# EasyEDA schematic EasyEDA_Esquematico.json
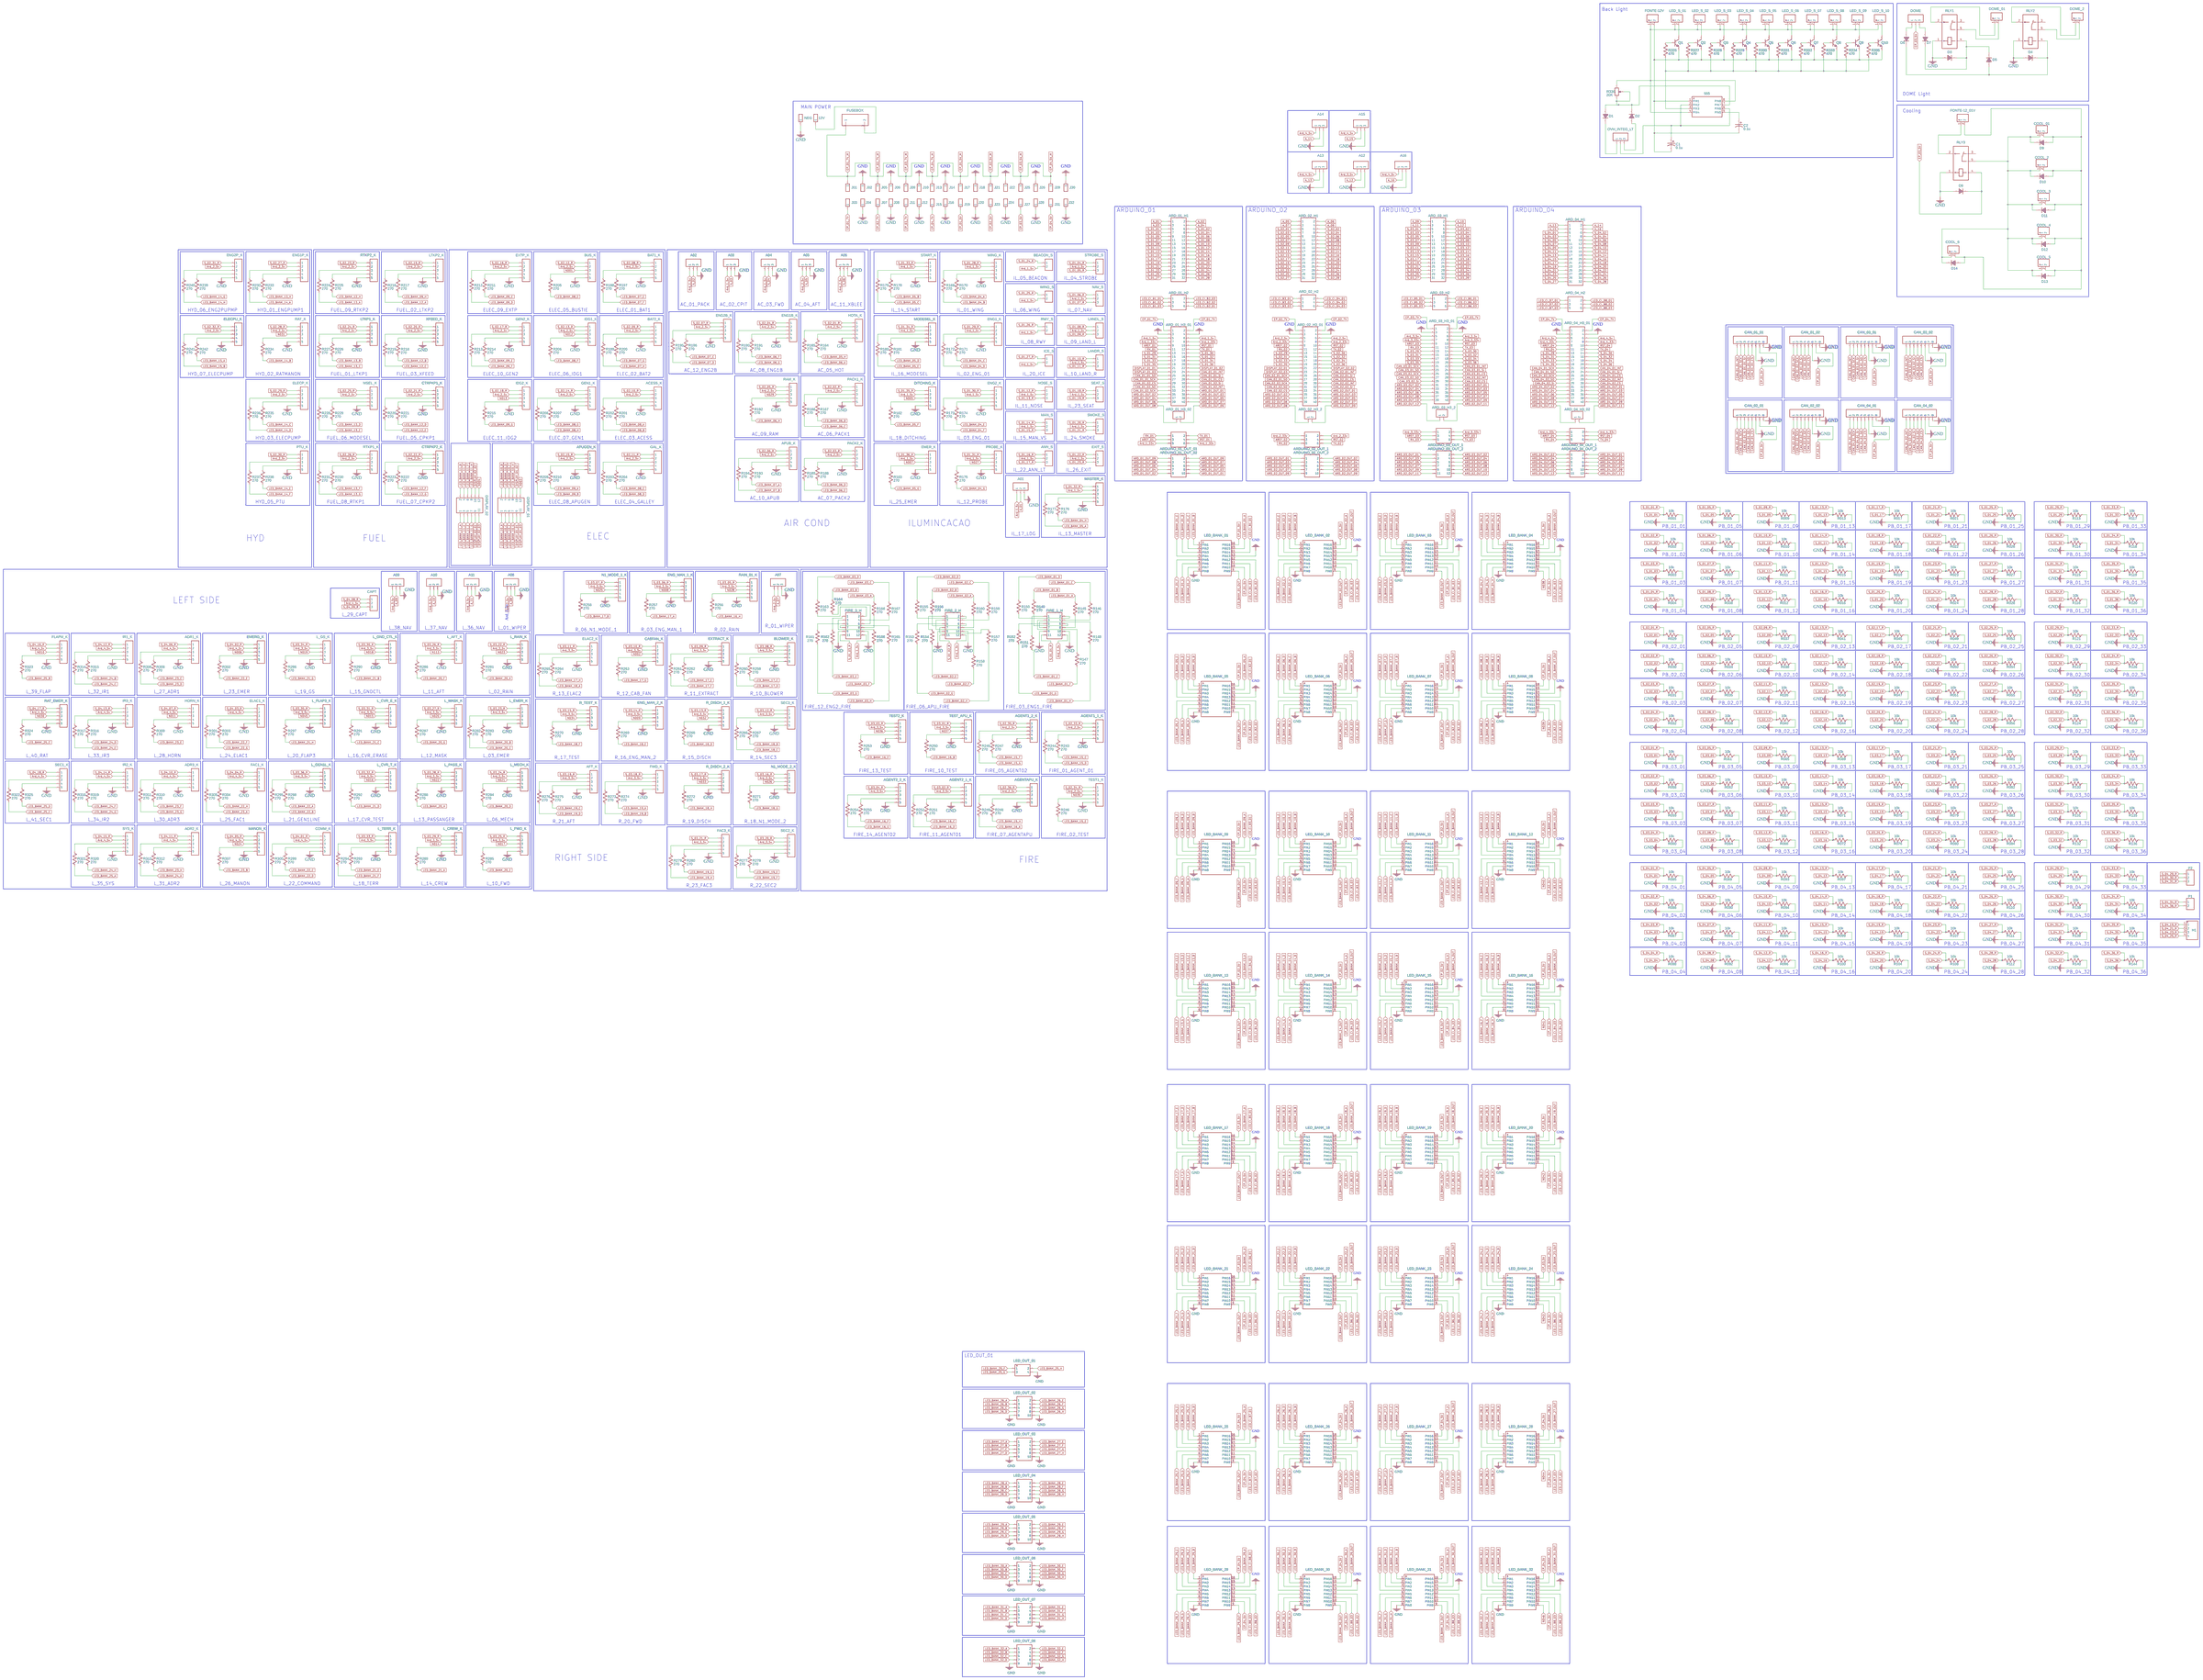
[diagram p0: schematic sheet]

## Parts
12V  HDR-M-2.54_1x1  [HDR-M-2.54_1X1]
555  DS1001-01-08BT1NSF6X-JKB  [DIP-8_L10.0-W6.5-P2.54-LS7.6-BL]
A01  Header-Male-2.54_1x3  [HDR-TH_3P-P2.54-V]
A02  Header-Male-2.54_1x3  [HDR-TH_3P-P2.54-V]
A03  Header-Male-2.54_1x3  [HDR-TH_3P-P2.54-V]
A04  Header-Male-2.54_1x3  [HDR-TH_3P-P2.54-V]
A05  Header-Male-2.54_1x3  [HDR-TH_3P-P2.54-V]
A06  Header-Male-2.54_1x3  [HDR-TH_3P-P2.54-V]
A07  Header-Male-2.54_1x3  [HDR-TH_3P-P2.54-V]
A08  Header-Male-2.54_1x3  [HDR-TH_3P-P2.54-V]
A09  Header-Male-2.54_1x3  [HDR-TH_3P-P2.54-V]
A10  Header-Male-2.54_1x3  [HDR-TH_3P-P2.54-V]
A11  Header-Male-2.54_1x3  [HDR-TH_3P-P2.54-V]
A12  Header-Male-2.54_1x3  [HDR-TH_3P-P2.54-V]
A13  Header-Male-2.54_1x3  [HDR-TH_3P-P2.54-V]
A14  Header-Male-2.54_1x3  [HDR-TH_3P-P2.54-V]
A15  Header-Male-2.54_1x3  [HDR-TH_3P-P2.54-V]
A16  Header-Male-2.54_1x3  [HDR-TH_3P-P2.54-V]
ACESS_K  Header-Female-2.54_1x5  [HDR-TH_5P-P2.54-V]
ADR1_K  Header-Female-2.54_1x5  [HDR-TH_5P-P2.54-V]
ADR2_K  Header-Female-2.54_1x5  [HDR-TH_5P-P2.54-V]
ADR3_K  Header-Female-2.54_1x5  [HDR-TH_5P-P2.54-V]
AFT_K  Header-Female-2.54_1x5  [HDR-TH_5P-P2.54-V]
AGENT1_1_K  Header-Female-2.54_1x5  [HDR-TH_5P-P2.54-V]
AGENT1_2_K  Header-Female-2.54_1x5  [HDR-TH_5P-P2.54-V]
AGENT2_1_K  Header-Female-2.54_1x5  [HDR-TH_5P-P2.54-V]
AGENT2_2_K  Header-Female-2.54_1x5  [HDR-TH_5P-P2.54-V]
AGENTAPU_K  Header-Female-2.54_1x5  [HDR-TH_5P-P2.54-V]
ANN_S  Header-Female-2.54_1x3  [HDR-TH_3P-P2.54-V]
APUB_K  Header-Female-2.54_1x5  [HDR-TH_5P-P2.54-V]
APUGEN_K  Header-Female-2.54_1x5  [HDR-TH_5P-P2.54-V]
ARD_01_H1  Header-Female-2.54_2x16  [HDR-TH_32P-P2.54-V-M-R2-C16-S2.54]
ARD_01_H2  Header-Female-2.54_2x3  [HDR-TH_6P-P2.54-V-R2-C3-S2.54]
ARD_01_H3_01  Header-Female-2.54_2x20  [HDR-TH_40P-P2.54-V-R2-C20-S2.54]
ARD_01_H3_02  Header-Female-2.54_1x2  [HDR-TH_2P-P2.54-V-M]
ARD_02_H1  Header-Female-2.54_2x16  [HDR-TH_32P-P2.54-V-M-R2-C16-S2.54]
ARD_02_H2  Header-Female-2.54_2x3  [HDR-TH_6P-P2.54-V-R2-C3-S2.54]
ARD_02_H3_01  Header-Female-2.54_2x20  [HDR-TH_40P-P2.54-V-R2-C20-S2.54]
ARD_02_H3_2  Header-Female-2.54_1x2  [HDR-TH_2P-P2.54-V-M]
ARD_03_H1  Header-Female-2.54_2x16  [HDR-TH_32P-P2.54-V-M-R2-C16-S2.54]
ARD_03_H2  Header-Female-2.54_2x3  [HDR-TH_6P-P2.54-V-R2-C3-S2.54]
ARD_03_H3_01  Header-Female-2.54_2x20  [HDR-TH_40P-P2.54-V-R2-C20-S2.54]
ARD_03_H3_2  Header-Female-2.54_1x2  [HDR-TH_2P-P2.54-V-M]
ARD_04_H1  Header-Female-2.54_2x16  [HDR-TH_32P-P2.54-V-M-R2-C16-S2.54]
ARD_04_H2  Header-Female-2.54_2x3  [HDR-TH_6P-P2.54-V-R2-C3-S2.54]
ARD_04_H3_01  Header-Female-2.54_2x20  [HDR-TH_40P-P2.54-V-R2-C20-S2.54]
ARD_04_H3_02  Header-Female-2.54_1x2  [HDR-TH_2P-P2.54-V-M]
ARDIUNO_04_OUT_2  Header-Female-2.54_2x6  [HDR-TH_12P-P2.54-V-R2-C6-S2.54]
ARDUINO_01_OUT_01  Header-Female-2.54_2x3  [HDR-TH_6P-P2.54-V-R2-C3-S2.54]
ARDUINO_01_OUT_02  Header-Female-2.54_2x5  [HDR-TH_10P-P2.54-V-R2-C5-S2.54]
ARDUINO_02_OUT_1  Header-Female-2.54_2x3  [HDR-TH_6P-P2.54-V-R2-C3-S2.54]
ARDUINO_02_OUT_2  Header-Female-2.54_2x5  [HDR-TH_10P-P2.54-V-R2-C5-S2.54]
ARDUINO_03_OUT_1  Header-Female-2.54_2x3  [HDR-TH_6P-P2.54-V-R2-C3-S2.54]
ARDUINO_03_OUT_2  Header-Female-2.54_2x6  [HDR-TH_12P-P2.54-V-R2-C6-S2.54]
ARDUINO_04_OUT_1  Header-Female-2.54_2x3  [HDR-TH_6P-P2.54-V-R2-C3-S2.54]
BAT1_K  Header-Female-2.54_1x5  [HDR-TH_5P-P2.54-V]
BAT2_K  Header-Female-2.54_1x5  [HDR-TH_5P-P2.54-V]
BEACON_S  Header-Female-2.54_1x2  [HDR-TH_2P-P2.54-V-M]
BLOWER_K  Header-Female-2.54_1x5  [HDR-TH_5P-P2.54-V]
BUS_K  Header-Female-2.54_1x5  [HDR-TH_5P-P2.54-V]
C1  0.1u  [CAP-D5.0×F2.0]
C2  0.1u  [CAP-D5.0×F2.0]
CABFAN_K  Header-Female-2.54_1x5  [HDR-TH_5P-P2.54-V]
CAN_01_01  Header-Female-2.54_1x8  [HDR-TH_8P-P2.54-V]
CAN_01_02  Header-Female-2.54_1x8  [HDR-TH_8P-P2.54-V]
CAN_02_01  Header-Female-2.54_1x8  [HDR-TH_8P-P2.54-V]
CAN_02_02  Header-Female-2.54_1x8  [HDR-TH_8P-P2.54-V]
CAN_03_01  Header-Female-2.54_1x8  [HDR-TH_8P-P2.54-V]
CAN_03_02  Header-Female-2.54_1x8  [HDR-TH_8P-P2.54-V]
CAN_04_01  Header-Female-2.54_1x8  [HDR-TH_8P-P2.54-V]
CAN_04_02  Header-Female-2.54_1x8  [HDR-TH_8P-P2.54-V]
CAPT  Header-Female-2.54_1x3  [HDR-TH_3P-P2.54-V]
COMM_K  Header-Female-2.54_1x5  [HDR-TH_5P-P2.54-V]
COOL_01  KF128R-5.0-2P  [CONN-TH_P5.00_KF128R-5.0-2P]
COOL_2  KF128R-5.0-2P  [CONN-TH_P5.00_KF128R-5.0-2P]
COOL_3  KF128R-5.0-2P  [CONN-TH_P5.00_KF128R-5.0-2P]
COOL_4  KF128R-5.0-2P  [CONN-TH_P5.00_KF128R-5.0-2P]
COOL_5  KF128R-5.0-2P  [CONN-TH_P5.00_KF128R-5.0-2P]
COOL_6  KF128R-5.0-2P  [CONN-TH_P5.00_KF128R-5.0-2P]
CTRPKP1_K  Header-Female-2.54_1x5  [HDR-TH_5P-P2.54-V]
CTRPKP2_K  Header-Female-2.54_1x5  [HDR-TH_5P-P2.54-V]
D1  1N4007  [DO-41_BD2.4-L4.7-P8.70-D0.9-RD]
D2  1N4007  [DO-41_BD2.4-L4.7-P8.70-D0.9-RD]
D3  1N4007  [DO-41_BD2.4-L4.7-P8.70-D0.9-RD]
D4  1N4007  [DO-41_BD2.4-L4.7-P8.70-D0.9-RD]
D5  1N4007  [DO-41_BD2.4-L4.7-P8.70-D0.9-RD]
D6  1N4007  [DO-41_BD2.4-L4.7-P8.70-D0.9-RD]
D7  1N4007  [DO-41_BD2.4-L4.7-P8.70-D0.9-RD]
D8  1N4007  [DO-41_BD2.4-L4.7-P8.70-D0.9-RD]
D9  1N4007  [DO-41_BD2.4-L4.7-P8.70-D0.9-RD]
D10  1N4007  [DO-41_BD2.4-L4.7-P8.70-D0.9-RD]
D11  1N4007  [DO-41_BD2.4-L4.7-P8.70-D0.9-RD]
D12  1N4007  [DO-41_BD2.4-L4.7-P8.70-D0.9-RD]
D13  1N4007  [DO-41_BD2.4-L4.7-P8.70-D0.9-RD]
D14  1N4007  [DO-41_BD2.4-L4.7-P8.70-D0.9-RD]
DISPLAY_01  Header-Female-2.54_2x6  [HDR-TH_12P-P2.54-V-R2-C6-S2.54]
DISPLAY_02  Header-Female-2.54_2x6  [HDR-TH_12P-P2.54-V-R2-C6-S2.54]
DITCHING_K  Header-Female-2.54_1x5  [HDR-TH_5P-P2.54-V]
DOME  Header-Male-2.54_1x3  [HDR-TH_3P-P2.54-V]
DOME_01  KF128R-5.0-2P  [CONN-TH_P5.00_KF128R-5.0-2P]
DOME_2  KF128R-5.0-2P  [CONN-TH_P5.00_KF128R-5.0-2P]
ELAC1_K  Header-Female-2.54_1x5  [HDR-TH_5P-P2.54-V]
ELAC2_K  Header-Female-2.54_1x5  [HDR-TH_5P-P2.54-V]
ELECP_K  Header-Female-2.54_1x5  [HDR-TH_5P-P2.54-V]
ELECPU_K  Header-Female-2.54_1x5  [HDR-TH_5P-P2.54-V]
EMER_K  Header-Female-2.54_1x5  [HDR-TH_5P-P2.54-V]
EMERG_K  Header-Female-2.54_1x5  [HDR-TH_5P-P2.54-V]
ENG1_K  Header-Female-2.54_1x5  [HDR-TH_5P-P2.54-V]
ENG1B_K  Header-Female-2.54_1x5  [HDR-TH_5P-P2.54-V]
ENG1P_K  Header-Female-2.54_1x5  [HDR-TH_5P-P2.54-V]
ENG2_K  Header-Female-2.54_1x5  [HDR-TH_5P-P2.54-V]
ENG2B_K  Header-Female-2.54_1x5  [HDR-TH_5P-P2.54-V]
ENG2P_K  Header-Female-2.54_1x5  [HDR-TH_5P-P2.54-V]
ENG_MAN_1_K  Header-Female-2.54_1x5  [HDR-TH_5P-P2.54-V]
ENG_MAN_2_K  Header-Female-2.54_1x5  [HDR-TH_5P-P2.54-V]
EXIT_S  Header-Female-2.54_1x3  [HDR-TH_3P-P2.54-V]
EXTP_K  Header-Female-2.54_1x5  [HDR-TH_5P-P2.54-V]
EXTRACT_K  Header-Female-2.54_1x5  [HDR-TH_5P-P2.54-V]
FAC1_K  Header-Female-2.54_1x5  [HDR-TH_5P-P2.54-V]
FAC3_K  Header-Female-2.54_1x5  [HDR-TH_5P-P2.54-V]
FIRE_1_H  Header-Female-2.54_2x6  [HDR-TH_12P-P2.54-V-R2-C6-S2.54]
FIRE_2_H  Header-Female-2.54_2x6  [HDR-TH_12P-P2.54-V-R2-C6-S2.54]
FIRE_3_H  Header-Female-2.54_2x6  [HDR-TH_12P-P2.54-V-R2-C6-S2.54]
FLAPM_K  Header-Female-2.54_1x5  [HDR-TH_5P-P2.54-V]
FONTE-12_01V  KF128R-5.0-2P  [CONN-TH_P5.00_KF128R-5.0-2P]
FONTE-12V  KF128R-5.0-2P  [CONN-TH_P5.00_KF128R-5.0-2P]
FUSEBOX  FuseBox3x60-Toth  [FUSEBOX3X60]
FWD_K  Header-Female-2.54_1x5  [HDR-TH_5P-P2.54-V]
GAL_K  Header-Female-2.54_1x5  [HDR-TH_5P-P2.54-V]
GEN1_K  Header-Female-2.54_1x5  [HDR-TH_5P-P2.54-V]
GEN2_K  Header-Female-2.54_1x5  [HDR-TH_5P-P2.54-V]
H1  Header-Male-2.54_1x4_C124378  [HDR-TH_4P-P2.54-V]
HORN_K  Header-Female-2.54_1x5  [HDR-TH_5P-P2.54-V]
HOTA_K  Header-Female-2.54_1x5  [HDR-TH_5P-P2.54-V]
ICE_S  Header-Female-2.54_1x2  [HDR-TH_2P-P2.54-V-M]
IDG1_K  Header-Female-2.54_1x5  [HDR-TH_5P-P2.54-V]
IDG2_K  Header-Female-2.54_1x5  [HDR-TH_5P-P2.54-V]
IR1_K  Header-Female-2.54_1x5  [HDR-TH_5P-P2.54-V]
IR2_K  Header-Female-2.54_1x5  [HDR-TH_5P-P2.54-V]
IR3_K  Header-Female-2.54_1x5  [HDR-TH_5P-P2.54-V]
J01  HDR-M-2.54_1x1  [HDR-M-2.54_1X1]
J02  HDR-M-2.54_1x1  [HDR-M-2.54_1X1]
J03  HDR-M-2.54_1x1  [HDR-M-2.54_1X1]
J04  HDR-M-2.54_1x1  [HDR-M-2.54_1X1]
J05  HDR-M-2.54_1x1  [HDR-M-2.54_1X1]
J06  HDR-M-2.54_1x1  [HDR-M-2.54_1X1]
J07  HDR-M-2.54_1x1  [HDR-M-2.54_1X1]
J08  HDR-M-2.54_1x1  [HDR-M-2.54_1X1]
J09  HDR-M-2.54_1x1  [HDR-M-2.54_1X1]
J10  HDR-M-2.54_1x1  [HDR-M-2.54_1X1]
J11  HDR-M-2.54_1x1  [HDR-M-2.54_1X1]
J12  HDR-M-2.54_1x1  [HDR-M-2.54_1X1]
J13  HDR-M-2.54_1x1  [HDR-M-2.54_1X1]
J14  HDR-M-2.54_1x1  [HDR-M-2.54_1X1]
J15  HDR-M-2.54_1x1  [HDR-M-2.54_1X1]
J16  HDR-M-2.54_1x1  [HDR-M-2.54_1X1]
J17  HDR-M-2.54_1x1  [HDR-M-2.54_1X1]
J18  HDR-M-2.54_1x1  [HDR-M-2.54_1X1]
J19  HDR-M-2.54_1x1  [HDR-M-2.54_1X1]
J20  HDR-M-2.54_1x1  [HDR-M-2.54_1X1]
J21  HDR-M-2.54_1x1  [HDR-M-2.54_1X1]
J22  HDR-M-2.54_1x1  [HDR-M-2.54_1X1]
J23  HDR-M-2.54_1x1  [HDR-M-2.54_1X1]
J24  HDR-M-2.54_1x1  [HDR-M-2.54_1X1]
J25  HDR-M-2.54_1x1  [HDR-M-2.54_1X1]
J26  HDR-M-2.54_1x1  [HDR-M-2.54_1X1]
J27  HDR-M-2.54_1x1  [HDR-M-2.54_1X1]
J28  HDR-M-2.54_1x1  [HDR-M-2.54_1X1]
J29  HDR-M-2.54_1x1  [HDR-M-2.54_1X1]
J30  HDR-M-2.54_1x1  [HDR-M-2.54_1X1]
J31  HDR-M-2.54_1x1  [HDR-M-2.54_1X1]
J32  HDR-M-2.54_1x1  [HDR-M-2.54_1X1]
L_AFT_K  Header-Female-2.54_1x5  [HDR-TH_5P-P2.54-V]
L_CREW_K  Header-Female-2.54_1x5  [HDR-TH_5P-P2.54-V]
L_CVR_E_K  Header-Female-2.54_1x5  [HDR-TH_5P-P2.54-V]
L_CVR_T_K  Header-Female-2.54_1x5  [HDR-TH_5P-P2.54-V]
L_EMER_K  Header-Female-2.54_1x5  [HDR-TH_5P-P2.54-V]
L_FLAP3_K  Header-Female-2.54_1x5  [HDR-TH_5P-P2.54-V]
L_FWD_K  Header-Female-2.54_1x5  [HDR-TH_5P-P2.54-V]
L_GEN1L_K  Header-Female-2.54_1x5  [HDR-TH_5P-P2.54-V]
L_GND_CTL_K  Header-Female-2.54_1x5  [HDR-TH_5P-P2.54-V]
L_GS_K  Header-Female-2.54_1x5  [HDR-TH_5P-P2.54-V]
L_MASK_K  Header-Female-2.54_1x5  [HDR-TH_5P-P2.54-V]
L_MECH_K  Header-Female-2.54_1x5  [HDR-TH_5P-P2.54-V]
L_PASS_K  Header-Female-2.54_1x5  [HDR-TH_5P-P2.54-V]
L_RAIN_K  Header-Female-2.54_1x5  [HDR-TH_5P-P2.54-V]
L_TERR_K  Header-Female-2.54_1x5  [HDR-TH_5P-P2.54-V]
LANDL_S  Header-Female-2.54_1x3  [HDR-TH_3P-P2.54-V]
LANDR_S  Header-Female-2.54_1x3  [HDR-TH_3P-P2.54-V]
LED_BANK_01  DS1001-01-16BT1NSF6X-JKB  [DIP-16_L20.3-W10.2-P2.54-LS10.2-BL]
LED_BANK_02  DS1001-01-16BT1NSF6X-JKB  [DIP-16_L20.3-W10.2-P2.54-LS10.2-BL]
LED_BANK_03  DS1001-01-16BT1NSF6X-JKB  [DIP-16_L20.3-W10.2-P2.54-LS10.2-BL]
LED_BANK_04  DS1001-01-16BT1NSF6X-JKB  [DIP-16_L20.3-W10.2-P2.54-LS10.2-BL]
LED_BANK_05  DS1001-01-16BT1NSF6X-JKB  [DIP-16_L20.3-W10.2-P2.54-LS10.2-BL]
LED_BANK_06  DS1001-01-16BT1NSF6X-JKB  [DIP-16_L20.3-W10.2-P2.54-LS10.2-BL]
LED_BANK_07  DS1001-01-16BT1NSF6X-JKB  [DIP-16_L20.3-W10.2-P2.54-LS10.2-BL]
LED_BANK_08  DS1001-01-16BT1NSF6X-JKB  [DIP-16_L20.3-W10.2-P2.54-LS10.2-BL]
LED_BANK_09  DS1001-01-16BT1NSF6X-JKB  [DIP-16_L20.3-W10.2-P2.54-LS10.2-BL]
LED_BANK_10  DS1001-01-16BT1NSF6X-JKB  [DIP-16_L20.3-W10.2-P2.54-LS10.2-BL]
LED_BANK_11  DS1001-01-16BT1NSF6X-JKB  [DIP-16_L20.3-W10.2-P2.54-LS10.2-BL]
LED_BANK_12  DS1001-01-16BT1NSF6X-JKB  [DIP-16_L20.3-W10.2-P2.54-LS10.2-BL]
LED_BANK_13  DS1001-01-16BT1NSF6X-JKB  [DIP-16_L20.3-W10.2-P2.54-LS10.2-BL]
LED_BANK_14  DS1001-01-16BT1NSF6X-JKB  [DIP-16_L20.3-W10.2-P2.54-LS10.2-BL]
LED_BANK_15  DS1001-01-16BT1NSF6X-JKB  [DIP-16_L20.3-W10.2-P2.54-LS10.2-BL]
LED_BANK_16  DS1001-01-16BT1NSF6X-JKB  [DIP-16_L20.3-W10.2-P2.54-LS10.2-BL]
LED_BANK_17  DS1001-01-16BT1NSF6X-JKB  [DIP-16_L20.3-W10.2-P2.54-LS10.2-BL]
LED_BANK_18  DS1001-01-16BT1NSF6X-JKB  [DIP-16_L20.3-W10.2-P2.54-LS10.2-BL]
LED_BANK_19  DS1001-01-16BT1NSF6X-JKB  [DIP-16_L20.3-W10.2-P2.54-LS10.2-BL]
LED_BANK_20  DS1001-01-16BT1NSF6X-JKB  [DIP-16_L20.3-W10.2-P2.54-LS10.2-BL]
LED_BANK_21  DS1001-01-16BT1NSF6X-JKB  [DIP-16_L20.3-W10.2-P2.54-LS10.2-BL]
LED_BANK_22  DS1001-01-16BT1NSF6X-JKB  [DIP-16_L20.3-W10.2-P2.54-LS10.2-BL]
LED_BANK_23  DS1001-01-16BT1NSF6X-JKB  [DIP-16_L20.3-W10.2-P2.54-LS10.2-BL]
LED_BANK_24  DS1001-01-16BT1NSF6X-JKB  [DIP-16_L20.3-W10.2-P2.54-LS10.2-BL]
LED_BANK_25  DS1001-01-16BT1NSF6X-JKB  [DIP-16_L20.3-W10.2-P2.54-LS10.2-BL]
LED_BANK_26  DS1001-01-16BT1NSF6X-JKB  [DIP-16_L20.3-W10.2-P2.54-LS10.2-BL]
LED_BANK_27  DS1001-01-16BT1NSF6X-JKB  [DIP-16_L20.3-W10.2-P2.54-LS10.2-BL]
LED_BANK_28  DS1001-01-16BT1NSF6X-JKB  [DIP-16_L20.3-W10.2-P2.54-LS10.2-BL]
LED_BANK_29  DS1001-01-16BT1NSF6X-JKB  [DIP-16_L20.3-W10.2-P2.54-LS10.2-BL]
LED_BANK_30  DS1001-01-16BT1NSF6X-JKB  [DIP-16_L20.3-W10.2-P2.54-LS10.2-BL]
LED_BANK_31  DS1001-01-16BT1NSF6X-JKB  [DIP-16_L20.3-W10.2-P2.54-LS10.2-BL]
LED_BANK_32  DS1001-01-16BT1NSF6X-JKB  [DIP-16_L20.3-W10.2-P2.54-LS10.2-BL]
LED_OUT_01  Header-Female-2.54_2x2  [HDR-TH_4P-P2.54-V-R2-C2-S2.54]
LED_OUT_02  Header-Female-2.54_2x5  [HDR-TH_10P-P2.54-V-R2-C5-S2.54]
LED_OUT_03  Header-Female-2.54_2x5  [HDR-TH_10P-P2.54-V-R2-C5-S2.54]
LED_OUT_04  Header-Female-2.54_2x5  [HDR-TH_10P-P2.54-V-R2-C5-S2.54]
LED_OUT_05  Header-Female-2.54_2x5  [HDR-TH_10P-P2.54-V-R2-C5-S2.54]
LED_OUT_06  Header-Female-2.54_2x5  [HDR-TH_10P-P2.54-V-R2-C5-S2.54]
LED_OUT_07  Header-Female-2.54_2x5  [HDR-TH_10P-P2.54-V-R2-C5-S2.54]
LED_OUT_08  Header-Female-2.54_2x5  [HDR-TH_10P-P2.54-V-R2-C5-S2.54]
LED_S_01  KF128R-5.0-2P  [CONN-TH_P5.00_KF128R-5.0-2P]
LED_S_02  KF128R-5.0-2P  [CONN-TH_P5.00_KF128R-5.0-2P]
LED_S_03  KF128R-5.0-2P  [CONN-TH_P5.00_KF128R-5.0-2P]
LED_S_04  KF128R-5.0-2P  [CONN-TH_P5.00_KF128R-5.0-2P]
LED_S_05  KF128R-5.0-2P  [CONN-TH_P5.00_KF128R-5.0-2P]
LED_S_06  KF128R-5.0-2P  [CONN-TH_P5.00_KF128R-5.0-2P]
LED_S_07  KF128R-5.0-2P  [CONN-TH_P5.00_KF128R-5.0-2P]
LED_S_08  KF128R-5.0-2P  [CONN-TH_P5.00_KF128R-5.0-2P]
LED_S_09  KF128R-5.0-2P  [CONN-TH_P5.00_KF128R-5.0-2P]
LED_S_10  KF128R-5.0-2P  [CONN-TH_P5.00_KF128R-5.0-2P]
LTKP1_K  Header-Female-2.54_1x5  [HDR-TH_5P-P2.54-V]
LTKP2_K  Header-Female-2.54_1x5  [HDR-TH_5P-P2.54-V]
MAN_S  Header-Female-2.54_1x3  [HDR-TH_3P-P2.54-V]
MANON_K  Header-Female-2.54_1x5  [HDR-TH_5P-P2.54-V]
MASTER_K  Header-Female-2.54_1x5  [HDR-TH_5P-P2.54-V]
MODESEL_K  Header-Female-2.54_1x5  [HDR-TH_5P-P2.54-V]
MSEL_K  Header-Female-2.54_1x5  [HDR-TH_5P-P2.54-V]
N1_MODE_1_K  Header-Female-2.54_1x5  [HDR-TH_5P-P2.54-V]
N1_MODE_2_K  Header-Female-2.54_1x5  [HDR-TH_5P-P2.54-V]
NAV_S  Header-Female-2.54_1x3  [HDR-TH_3P-P2.54-V]
NEG  HDR-M-2.54_1x1  [HDR-M-2.54_1X1]
NOSE_S  Header-Female-2.54_1x3  [HDR-TH_3P-P2.54-V]
OVH_INTEG_LT  Header-Female-2.54_1x3  [HDR-TH_3P-P2.54-V]
P1  Header-Female-2.54_1x2  [HDR-TH_2P-P2.54-V-M]
P2  Header-Female-2.54_1x3  [HDR-TH_3P-P2.54-V]
PACK1_K  Header-Female-2.54_1x5  [HDR-TH_5P-P2.54-V]
PACK2_K  Header-Female-2.54_1x5  [HDR-TH_5P-P2.54-V]
PROBE_K  Header-Female-2.54_1x5  [HDR-TH_5P-P2.54-V]
PTU_K  Header-Female-2.54_1x5  [HDR-TH_5P-P2.54-V]
Q1  TIP41C  [TO-220-3_L10.0-W4.5-P2.54-T]
Q2  TIP41C  [TO-220-3_L10.0-W4.5-P2.54-T]
Q3  TIP41C  [TO-220-3_L10.0-W4.5-P2.54-T]
Q4  TIP41C  [TO-220-3_L10.0-W4.5-P2.54-T]
Q5  TIP41C  [TO-220-3_L10.0-W4.5-P2.54-T]
Q6  TIP41C  [TO-220-3_L10.0-W4.5-P2.54-T]
Q7  TIP41C  [TO-220-3_L10.0-W4.5-P2.54-T]
Q8  TIP41C  [TO-220-3_L10.0-W4.5-P2.54-T]
Q9  TIP41C  [TO-220-3_L10.0-W4.5-P2.54-T]
Q10  TIP41C  [TO-220-3_L10.0-W4.5-P2.54-T]
R001  10k  [R_AXIAL-0.3]
R002  10k  [R_AXIAL-0.3]
R003  10k  [R_AXIAL-0.3]
R004  10k  [R_AXIAL-0.3]
R005  10k  [R_AXIAL-0.3]
R006  10k  [R_AXIAL-0.3]
R007  10k  [R_AXIAL-0.3]
R008  10k  [R_AXIAL-0.3]
R009  10k  [R_AXIAL-0.3]
R010  10k  [R_AXIAL-0.3]
R011  10k  [R_AXIAL-0.3]
R012  10k  [R_AXIAL-0.3]
R013  10k  [R_AXIAL-0.3]
R014  10k  [R_AXIAL-0.3]
R015  10k  [R_AXIAL-0.3]
R016  10k  [R_AXIAL-0.3]
R017  10k  [R_AXIAL-0.3]
R018  10k  [R_AXIAL-0.3]
R019  10k  [R_AXIAL-0.3]
R020  10k  [R_AXIAL-0.3]
R021  10k  [R_AXIAL-0.3]
R022  10k  [R_AXIAL-0.3]
R023  10k  [R_AXIAL-0.3]
R024  10k  [R_AXIAL-0.3]
R025  10k  [R_AXIAL-0.3]
R026  10k  [R_AXIAL-0.3]
R027  10k  [R_AXIAL-0.3]
R028  10k  [R_AXIAL-0.3]
R029  10k  [R_AXIAL-0.3]
R030  10k  [R_AXIAL-0.3]
R031  10k  [R_AXIAL-0.3]
R032  10k  [R_AXIAL-0.3]
R033  10k  [R_AXIAL-0.3]
R034  10k  [R_AXIAL-0.3]
R035  10k  [R_AXIAL-0.3]
R036  10k  [R_AXIAL-0.3]
R037  10k  [R_AXIAL-0.3]
R038  10k  [R_AXIAL-0.3]
R039  10k  [R_AXIAL-0.3]
R040  10k  [R_AXIAL-0.3]
R041  10k  [R_AXIAL-0.3]
R042  10k  [R_AXIAL-0.3]
R043  10k  [R_AXIAL-0.3]
R044  10k  [R_AXIAL-0.3]
R045  10k  [R_AXIAL-0.3]
R046  10k  [R_AXIAL-0.3]
R047  10k  [R_AXIAL-0.3]
R048  10k  [R_AXIAL-0.3]
R049  10k  [R_AXIAL-0.3]
R050  10k  [R_AXIAL-0.3]
R051  10k  [R_AXIAL-0.3]
R052  10k  [R_AXIAL-0.3]
R053  10k  [R_AXIAL-0.3]
R054  10k  [R_AXIAL-0.3]
R055  10k  [R_AXIAL-0.3]
R056  10k  [R_AXIAL-0.3]
R057  10k  [R_AXIAL-0.3]
R058  10k  [R_AXIAL-0.3]
R059  10k  [R_AXIAL-0.3]
R060  10k  [R_AXIAL-0.3]
R061  10k  [R_AXIAL-0.3]
R062  10k  [R_AXIAL-0.3]
R063  10k  [R_AXIAL-0.3]
R064  10k  [R_AXIAL-0.3]
R065  10k  [R_AXIAL-0.3]
R066  10k  [R_AXIAL-0.3]
R067  10k  [R_AXIAL-0.3]
R068  10k  [R_AXIAL-0.3]
R069  10k  [R_AXIAL-0.3]
R070  10k  [R_AXIAL-0.3]
R071  10k  [R_AXIAL-0.3]
R072  10k  [R_AXIAL-0.3]
R073  10k  [R_AXIAL-0.3]
R074  10k  [R_AXIAL-0.3]
R075  10k  [R_AXIAL-0.3]
R076  10k  [R_AXIAL-0.3]
R077  10k  [R_AXIAL-0.3]
R078  10k  [R_AXIAL-0.3]
R079  10k  [R_AXIAL-0.3]
R080  10k  [R_AXIAL-0.3]
R081  10k  [R_AXIAL-0.3]
R082  10k  [R_AXIAL-0.3]
R083  10k  [R_AXIAL-0.3]
R084  10k  [R_AXIAL-0.3]
R085  10k  [R_AXIAL-0.3]
R086  10k  [R_AXIAL-0.3]
R087  10k  [R_AXIAL-0.3]
R088  10k  [R_AXIAL-0.3]
R089  10k  [R_AXIAL-0.3]
R090  10k  [R_AXIAL-0.3]
R091  10k  [R_AXIAL-0.3]
R092  10k  [R_AXIAL-0.3]
R093  10k  [R_AXIAL-0.3]
R094  10k  [R_AXIAL-0.3]
R095  10k  [R_AXIAL-0.3]
R096  10k  [R_AXIAL-0.3]
R097  10k  [R_AXIAL-0.3]
R098  10k  [R_AXIAL-0.3]
R099  10k  [R_AXIAL-0.3]
R100  10k  [R_AXIAL-0.3]
R101  10k  [R_AXIAL-0.3]
R102  10k  [R_AXIAL-0.3]
R103  10k  [R_AXIAL-0.3]
R104  10k  [R_AXIAL-0.3]
R105  10k  [R_AXIAL-0.3]
R106  10k  [R_AXIAL-0.3]
R107  10k  [R_AXIAL-0.3]
R108  10k  [R_AXIAL-0.3]
R109  10k  [R_AXIAL-0.3]
R110  10k  [R_AXIAL-0.3]
R111  10k  [R_AXIAL-0.3]
R112  10k  [R_AXIAL-0.3]
R113  10k  [R_AXIAL-0.3]
R114  10k  [R_AXIAL-0.3]
R115  10k  [R_AXIAL-0.3]
R116  10k  [R_AXIAL-0.3]
R117  10k  [R_AXIAL-0.3]
R118  10k  [R_AXIAL-0.3]
R119  10k  [R_AXIAL-0.3]
R120  10k  [R_AXIAL-0.3]
R121  10k  [R_AXIAL-0.3]
R122  10k  [R_AXIAL-0.3]
R123  10k  [R_AXIAL-0.3]
R124  10k  [R_AXIAL-0.3]
R125  10k  [R_AXIAL-0.3]
R126  10k  [R_AXIAL-0.3]
R127  10k  [R_AXIAL-0.3]
R128  10k  [R_AXIAL-0.3]
R129  10k  [R_AXIAL-0.3]
R130  10k  [R_AXIAL-0.3]
R131  10k  [R_AXIAL-0.3]
R132  10k  [R_AXIAL-0.3]
R133  10k  [R_AXIAL-0.3]
R134  10k  [R_AXIAL-0.3]
R135  10k  [R_AXIAL-0.3]
R136  10k  [R_AXIAL-0.3]
R137  10k  [R_AXIAL-0.3]
R138  10k  [R_AXIAL-0.3]
R139  10k  [R_AXIAL-0.3]
R140  10k  [R_AXIAL-0.3]
R141  10k  [R_AXIAL-0.3]
R142  10k  [R_AXIAL-0.3]
R143  10k  [R_AXIAL-0.3]
R144  10k  [R_AXIAL-0.3]
R145  270  [R_AXIAL-0.3]
R146  270  [R_AXIAL-0.3]
R147  270  [R_AXIAL-0.3]
R148  270  [R_AXIAL-0.3]
R149  270  [R_AXIAL-0.3]
R150  270  [R_AXIAL-0.3]
R151  270  [R_AXIAL-0.3]
R152  270  [R_AXIAL-0.3]
R153  270  [R_AXIAL-0.3]
R154  270  [R_AXIAL-0.3]
R155  270  [R_AXIAL-0.3]
R156  270  [R_AXIAL-0.3]
R157  270  [R_AXIAL-0.3]
R158  270  [R_AXIAL-0.3]
R159  270  [R_AXIAL-0.3]
R160  270  [R_AXIAL-0.3]
R161  270  [R_AXIAL-0.3]
R162  270  [R_AXIAL-0.3]
R163  270  [R_AXIAL-0.3]
R164  270  [R_AXIAL-0.3]
R165  270  [R_AXIAL-0.3]
R166  270  [R_AXIAL-0.3]
R167  270  [R_AXIAL-0.3]
R168  270  [R_AXIAL-0.3]
R169  270  [R_AXIAL-0.3]
R170  270  [R_AXIAL-0.3]
R171  270  [R_AXIAL-0.3]
R172  270  [R_AXIAL-0.3]
R173  270  [R_AXIAL-0.3]
R174  270  [R_AXIAL-0.3]
R175  270  [R_AXIAL-0.3]
R176  270  [R_AXIAL-0.3]
R177  270  [R_AXIAL-0.3]
R178  270  [R_AXIAL-0.3]
R179  270  [R_AXIAL-0.3]
R180  270  [R_AXIAL-0.3]
R181  270  [R_AXIAL-0.3]
R182  270  [R_AXIAL-0.3]
R183  270  [R_AXIAL-0.3]
R184  270  [R_AXIAL-0.3]
R185  270  [R_AXIAL-0.3]
R186  270  [R_AXIAL-0.3]
R187  270  [R_AXIAL-0.3]
R188  270  [R_AXIAL-0.3]
R189  270  [R_AXIAL-0.3]
R190  270  [R_AXIAL-0.3]
R191  270  [R_AXIAL-0.3]
R192  270  [R_AXIAL-0.3]
R193  270  [R_AXIAL-0.3]
R194  270  [R_AXIAL-0.3]
R195  270  [R_AXIAL-0.3]
R196  270  [R_AXIAL-0.3]
R197  270  [R_AXIAL-0.3]
R198  270  [R_AXIAL-0.3]
R199  270  [R_AXIAL-0.3]
R200  270  [R_AXIAL-0.3]
R201  270  [R_AXIAL-0.3]
R202  270  [R_AXIAL-0.3]
R203  270  [R_AXIAL-0.3]
R204  270  [R_AXIAL-0.3]
R205  270  [R_AXIAL-0.3]
R206  270  [R_AXIAL-0.3]
R207  270  [R_AXIAL-0.3]
R208  270  [R_AXIAL-0.3]
R209  270  [R_AXIAL-0.3]
R210  270  [R_AXIAL-0.3]
R211  270  [R_AXIAL-0.3]
R212  270  [R_AXIAL-0.3]
R213  270  [R_AXIAL-0.3]
R214  270  [R_AXIAL-0.3]
R215  270  [R_AXIAL-0.3]
R216  270  [R_AXIAL-0.3]
R217  270  [R_AXIAL-0.3]
R218  270  [R_AXIAL-0.3]
R219  270  [R_AXIAL-0.3]
R220  270  [R_AXIAL-0.3]
R221  270  [R_AXIAL-0.3]
R222  270  [R_AXIAL-0.3]
R223  270  [R_AXIAL-0.3]
R224  270  [R_AXIAL-0.3]
R225  270  [R_AXIAL-0.3]
R226  270  [R_AXIAL-0.3]
R227  270  [R_AXIAL-0.3]
R228  270  [R_AXIAL-0.3]
R229  270  [R_AXIAL-0.3]
R230  270  [R_AXIAL-0.3]
R231  270  [R_AXIAL-0.3]
R232  270  [R_AXIAL-0.3]
R233  270  [R_AXIAL-0.3]
R234  270  [R_AXIAL-0.3]
R235  270  [R_AXIAL-0.3]
R236  270  [R_AXIAL-0.3]
R237  270  [R_AXIAL-0.3]
R238  270  [R_AXIAL-0.3]
R239  270  [R_AXIAL-0.3]
R240  270  [R_AXIAL-0.3]
R241  270  [R_AXIAL-0.3]
R242  270  [R_AXIAL-0.3]
R243  270  [R_AXIAL-0.3]
R244  270  [R_AXIAL-0.3]
R245  270  [R_AXIAL-0.3]
R246  270  [R_AXIAL-0.3]
R247  270  [R_AXIAL-0.3]
R248  270  [R_AXIAL-0.3]
R249  270  [R_AXIAL-0.3]
R250  270  [R_AXIAL-0.3]
R251  270  [R_AXIAL-0.3]
R252  270  [R_AXIAL-0.3]
R253  270  [R_AXIAL-0.3]
R254  270  [R_AXIAL-0.3]
R255  270  [R_AXIAL-0.3]
R256  270  [R_AXIAL-0.3]
R257  270  [R_AXIAL-0.3]
R258  270  [R_AXIAL-0.3]
R259  270  [R_AXIAL-0.3]
R260  270  [R_AXIAL-0.3]
R261  270  [R_AXIAL-0.3]
R262  270  [R_AXIAL-0.3]
R263  270  [R_AXIAL-0.3]
R264  270  [R_AXIAL-0.3]
R265  270  [R_AXIAL-0.3]
R266  270  [R_AXIAL-0.3]
R267  270  [R_AXIAL-0.3]
R268  270  [R_AXIAL-0.3]
R269  270  [R_AXIAL-0.3]
R270  270  [R_AXIAL-0.3]
R271  270  [R_AXIAL-0.3]
R272  270  [R_AXIAL-0.3]
R273  270  [R_AXIAL-0.3]
R274  270  [R_AXIAL-0.3]
R275  270  [R_AXIAL-0.3]
R276  270  [R_AXIAL-0.3]
R277  270  [R_AXIAL-0.3]
R278  270  [R_AXIAL-0.3]
R279  270  [R_AXIAL-0.3]
R280  270  [R_AXIAL-0.3]
R281  270  [R_AXIAL-0.3]
R282  270  [R_AXIAL-0.3]
R283  270  [R_AXIAL-0.3]
R284  270  [R_AXIAL-0.3]
R285  270  [R_AXIAL-0.3]
R286  270  [R_AXIAL-0.3]
R287  270  [R_AXIAL-0.3]
R288  270  [R_AXIAL-0.3]
R289  270  [R_AXIAL-0.3]
R290  270  [R_AXIAL-0.3]
R291  270  [R_AXIAL-0.3]
R292  270  [R_AXIAL-0.3]
R293  270  [R_AXIAL-0.3]
R294  270  [R_AXIAL-0.3]
R295  270  [R_AXIAL-0.3]
R296  270  [R_AXIAL-0.3]
R297  270  [R_AXIAL-0.3]
R298  270  [R_AXIAL-0.3]
R299  270  [R_AXIAL-0.3]
R300  270  [R_AXIAL-0.3]
R301  270  [R_AXIAL-0.3]
R302  270  [R_AXIAL-0.3]
R303  270  [R_AXIAL-0.3]
R304  270  [R_AXIAL-0.3]
R305  270  [R_AXIAL-0.3]
R306  270  [R_AXIAL-0.3]
R307  270  [R_AXIAL-0.3]
R308  270  [R_AXIAL-0.3]
R309  270  [R_AXIAL-0.3]
R310  270  [R_AXIAL-0.3]
R311  270  [R_AXIAL-0.3]
R312  270  [R_AXIAL-0.3]
R313  270  [R_AXIAL-0.3]
R314  270  [R_AXIAL-0.3]
R315  270  [R_AXIAL-0.3]
R316  270  [R_AXIAL-0.3]
R317  270  [R_AXIAL-0.3]
R318  270  [R_AXIAL-0.3]
R319  270  [R_AXIAL-0.3]
R320  270  [R_AXIAL-0.3]
R321  270  [R_AXIAL-0.3]
R322  270  [R_AXIAL-0.3]
R323  270  [R_AXIAL-0.3]
R324  270  [R_AXIAL-0.3]
R325  270  [R_AXIAL-0.3]
R326  470  [R_AXIAL-0.3]
R327  470  [R_AXIAL-0.3]
R328  470  [R_AXIAL-0.3]
R329  470  [R_AXIAL-0.3]
R330  470  [R_AXIAL-0.3]
R331  470  [R_AXIAL-0.3]
R332  470  [R_AXIAL-0.3]
R333  470  [R_AXIAL-0.3]
R334  470  [R_AXIAL-0.3]
R335  470  [R_AXIAL-0.3]
R336  20K  [RES-ADJ-TH_EVND8AA]
R_DISCH_1_K  Header-Female-2.54_1x5  [HDR-TH_5P-P2.54-V]
R_DISCH_2_K  Header-Female-2.54_1x5  [HDR-TH_5P-P2.54-V]
R_TEST_K  Header-Female-2.54_1x5  [HDR-TH_5P-P2.54-V]
RAIN_01_K  Header-Female-2.54_1x5  [HDR-TH_5P-P2.54-V]
RAM_K  Header-Female-2.54_1x5  [HDR-TH_5P-P2.54-V]
RAT_EMER_K  Header-Female-2.54_1x5  [HDR-TH_5P-P2.54-V]
RAT_K  Header-Female-2.54_1x5  [HDR-TH_5P-P2.54-V]
RLY1  SRD-05VDC-SL-C  [RELAY-TH_SRD-XXVDC-XL-C]
RLY2  SRD-05VDC-SL-C  [RELAY-TH_SRD-XXVDC-XL-C]
RLY3  SRD-05VDC-SL-C  [RELAY-TH_SRD-XXVDC-XL-C]
RTKP1_K  Header-Female-2.54_1x5  [HDR-TH_5P-P2.54-V]
RTKP2_K  Header-Female-2.54_1x5  [HDR-TH_5P-P2.54-V]
RWY_S  Header-Female-2.54_1x2  [HDR-TH_2P-P2.54-V-M]
SEAT_S  Header-Female-2.54_1x3  [HDR-TH_3P-P2.54-V]
SEC1_K  Header-Female-2.54_1x5  [HDR-TH_5P-P2.54-V]
SEC2_K  Header-Female-2.54_1x5  [HDR-TH_5P-P2.54-V]
SEC3_K  Header-Female-2.54_1x5  [HDR-TH_5P-P2.54-V]
SMOKE_S  Header-Female-2.54_1x3  [HDR-TH_3P-P2.54-V]
START_K  Header-Female-2.54_1x5  [HDR-TH_5P-P2.54-V]
STROBE_S  Header-Female-2.54_1x3  [HDR-TH_3P-P2.54-V]
SYS_K  Header-Female-2.54_1x5  [HDR-TH_5P-P2.54-V]
TEST1_K  Header-Female-2.54_1x5  [HDR-TH_5P-P2.54-V]
TEST2_K  Header-Female-2.54_1x5  [HDR-TH_5P-P2.54-V]
TEST_APU_K  Header-Female-2.54_1x5  [HDR-TH_5P-P2.54-V]
WING_K  Header-Female-2.54_1x5  [HDR-TH_5P-P2.54-V]
WING_S  Header-Female-2.54_1x2  [HDR-TH_2P-P2.54-V-M]
XFEED_K  Header-Female-2.54_1x5  [HDR-TH_5P-P2.54-V]

## Library data of the parts
12V J01 J02 J03 J04 J05 J06 J07 J08 J09-J32 NEG = HDR-M-2.54_1x1: Supplier Part: C81276; Supplier: LCSC; Contributor: LCEDA_Lib
555 = DS1001-01-08BT1NSF6X-JKB: Supplier: LCSC; Manufacturer: CONNFLY; Supplier Part: C72129
A01 A02 A03 A04 A05 A06 A07 A08 A09-A16 DOME = Header-Male-2.54_1x3: Supplier: LCSC; Manufacturer: BOOMELE; Manufacturer Part: Header2.54mm 1*3P; image: //image.lceda.cn/szlcsc/C49257.jpg; Supplier Part: C49257
ACESS_K ADR1_K ADR2_K ADR3_K AFT_K AGENT1_1_K AGENT1_2_K AGENT2_1_K AGENT2_2_K AGENTAPU_K APUB_K APUGEN_K BAT1_K BAT2_K BLOWER_K BUS_K CABFAN_K COMM_K CTRPKP1_K CTRPKP2_K DITCHING_K ELAC1_K ELAC2_K ELECP_K ELECPU_K EMER_K EMERG_K ENG1_K ENG1B_K ENG1P_K ENG2_K ENG2B_K ENG2P_K ENG_MAN_1_K ENG_MAN_2_K EXTP_K EXTRACT_K FAC1_K FAC3_K FLAPM_K FWD_K GAL_K GEN1_K GEN2_K HORN_K HOTA_K IDG1_K IDG2_K IR1_K IR2_K IR3_K L_AFT_K L_CREW_K L_CVR_E_K L_CVR_T_K L_EMER_K L_FLAP3_K L_FWD_K L_GEN1L_K L_GND_CTL_K L_GS_K L_MASK_K L_MECH_K L_PASS_K L_RAIN_K L_TERR_K LTKP1_K LTKP2_K MANON_K MASTER_K MODESEL_K MSEL_K N1_MODE_1_K N1_MODE_2_K PACK1_K PACK2_K PROBE_K PTU_K R_DISCH_1_K R_DISCH_2_K R_TEST_K RAIN_01_K RAM_K RAT_EMER_K RAT_K RTKP1_K RTKP2_K SEC1_K SEC2_K SEC3_K START_K SYS_K TEST1_K TEST2_K TEST_APU_K WING_K XFEED_K = Header-Female-2.54_1x5: Supplier: LCSC; Manufacturer: BOOMELE; Manufacturer Part: 2.54mm 1*5p Female header; image: //image.lceda.cn/szlcsc/C50950.jpg; Supplier Part: C50950
ANN_S CAPT EXIT_S LANDL_S LANDR_S MAN_S NAV_S NOSE_S OVH_INTEG_LT P2 SEAT_S SMOKE_S STROBE_S = Header-Female-2.54_1x3: Supplier Part: C146243; Supplier: LCSC; Manufacturer: Boom Precision Elec; link: https://datasheet.lcsc.com/szlcsc/Boom-Precision-Elec-2-54mm-1-8P-Straight-Female-header_C27438.pdf
ARD_01_H1 ARD_02_H1 ARD_03_H1 ARD_04_H1 = Header-Female-2.54_2x16: Supplier: LCSC; Manufacturer: BOOMELE; Manufacturer Part: 2.54mm,2×16Double female header; image: //image.lceda.cn/szlcsc/C24778.jpg; Supplier Part: C24778
ARD_01_H2 ARD_02_H2 ARD_03_H2 ARD_04_H2 ARDUINO_01_OUT_01 ARDUINO_02_OUT_1 ARDUINO_03_OUT_1 ARDUINO_04_OUT_1 = Header-Female-2.54_2x3: Supplier: LCSC; Manufacturer: CONNFLY; Manufacturer Part: DS1023-2*3SF11; Contributor: LCSC; Supplier Part: C92272
ARD_01_H3_01 ARD_02_H3_01 ARD_03_H3_01 ARD_04_H3_01 = Header-Female-2.54_2x20: Supplier: LCSC; Manufacturer: BOOMELE; Manufacturer Part: 2.54mm 2*20PFemale header; image: //image.lceda.cn/szlcsc/C50982.jpg; Supplier Part: C50982
ARD_01_H3_02 ARD_02_H3_2 ARD_03_H3_2 ARD_04_H3_02 BEACON_S ICE_S P1 RWY_S WING_S = Header-Female-2.54_1x2: Supplier: LCSC; Manufacturer: BOOMELE; Manufacturer Part: 2.54-1*2PFemale; image: //image.lceda.cn/szlcsc/C49661.jpg; Supplier Part: C49661
ARDIUNO_04_OUT_2 ARDUINO_03_OUT_2 DISPLAY_01 DISPLAY_02 FIRE_1_H FIRE_2_H FIRE_3_H = Header-Female-2.54_2x6: Supplier: LCSC; Manufacturer: BOOMELE; image: //image.lceda.cn/szlcsc/C36191.jpg; Supplier Part: C36191
ARDUINO_01_OUT_02 ARDUINO_02_OUT_2 LED_OUT_02 LED_OUT_03 LED_OUT_04 LED_OUT_05 LED_OUT_06 LED_OUT_07 LED_OUT_08 = Header-Female-2.54_2x5: Supplier: LCSC; Manufacturer: Ckmtw; Manufacturer Part: 220S-2*5P H=8.5MM Ytype Gold-plated; Supplier Part: C124423
C1 C2 = CE_TH_D5.0×F2.0_US: Contributor: LCEDA_Lib
CAN_01_01 CAN_01_02 CAN_02_01 CAN_02_02 CAN_03_01 CAN_03_02 CAN_04_01 CAN_04_02 = Header-Female-2.54_1x8: Supplier: LCSC; Manufacturer: BOOMELE; Manufacturer Part: Female headerHDR1X8-2.54; Supplier Part: C27438
COOL_01-COOL_6 DOME_01 DOME_2 FONTE-12_01V FONTE-12V LED_S_01 LED_S_02 LED_S_03 LED_S_04 LED_S_05 LED_S_06 LED_S_07 LED_S_08 LED_S_09 LED_S_10 = KF128R-5.0-2P: Supplier: LCSC; Supplier Part: C475080; Manufacturer: Cixi Kefa Elec; Contributor: LCSC
D1-D14 = 1N4007: Supplier: LCSC; Manufacturer: SEMTECH; Supplier Part: C106903
FUSEBOX = FuseBox3x60-Toth: Contributor: phtoth
H1 = Header-Male-2.54_1x4_C124378: Supplier: LCSC; Manufacturer: Ckmtw; Manufacturer Part: 210S-1*4P L=11.6MMGold-plated black; Contributor: LCSC; Supplier Part: C124378
LED_BANK_01 LED_BANK_02 LED_BANK_03 LED_BANK_04 LED_BANK_05 LED_BANK_06 LED_BANK_07 LED_BANK_08 LED_BANK_09-LED_BANK_32 = DS1001-01-16BT1NSF6X-JKB: Supplier: LCSC; Manufacturer: CONNFLY; Supplier Part: C72130
LED_OUT_01 = Header-Female-2.54_2x2: Supplier: LCSC; Manufacturer: CONNFLY; Manufacturer Part: DS1023-2*2SF11; Contributor: LCSC; Supplier Part: C92273
Q1-Q10 = TIP41C: Supplier: LCSC; Manufacturer: CJ; Supplier Part: C92310
R001 R002 R003 R004 R005 R006 R007 R008 R009 R010 R011 R012 R013 R014 R015 R016 R017 R018 R019 R020 R021 R022 R023 R024 R025 R026 R027 R028 R029 R030 R031 R032 R033 R034 R035 R036 R037 R038 R039 R040 R041 R042 R043 R044 R045 R046 R047 R048 R049 R050 R051 R052 R053 R054 R055 R056 R057 R058 R059 R060 R061 R062 R063 R064 R065 R066 R067 R068 R069 R070 R071 R072 R073 R074 R075 R076 R077 R078 R079 R080 R081 R082 R083 R084 R085 R086 R087 R088 R089 R090 R091 R092 R093 R094 R095 R096 R097 R098 R099-R335 = R_AXIAL-0.3_US: Contributor: LCEDA_Lib
R336 = EVND8AA03B24: Supplier: LCSC; Manufacturer: PANASONIC; Contributor: LCSC; Supplier Part: C5017
RLY1-RLY3 = SRD-05VDC-SL-C: Supplier: LCSC; Manufacturer: SONGLE; image: //image.lceda.cn/szlcsc/C35449.jpg; Supplier Part: C35449

## Nets
GND: A01.3 A02.3 A03.3 A04.3 A05.3 A06.3 A07.3 A08.3 A09.3 A10.3 A11.3 A12.3 A13.3 A14.3 A15.3 A16.3 ACESS_K.5 ADR1_K.5 ADR2_K.5 ADR3_K.5 AFT_K.5 AGENT1_1_K.5 AGENT1_2_K.5 AGENT2_1_K.5 AGENT2_2_K.5 AGENTAPU_K.5 APUB_K.5 APUGEN_K.5 ARD_01_H3_01.3 ARD_01_H3_01.4 ARD_02_H3_01.3 ARD_02_H3_01.4 ARD_03_H3_01.3 ARD_03_H3_01.4 ARD_04_H3_01.3 ARD_04_H3_01.4 BAT1_K.5 BAT2_K.5 BLOWER_K.5 BUS_K.5 CABFAN_K.5 CAN_01_01.6 CAN_01_01.8 CAN_01_02.6 CAN_01_02.8 CAN_02_01.6 CAN_02_01.8 CAN_02_02.6 CAN_02_02.8 CAN_03_01.6 CAN_03_01.8 CAN_03_02.6 CAN_03_02.8 CAN_04_01.6 CAN_04_01.8 CAN_04_02.6 CAN_04_02.8 COMM_K.5 CTRPKP1_K.5 CTRPKP2_K.5 D3.2(A) D4.2(A) D8.2(A) DITCHING_K.5 ELAC1_K.5 ELAC2_K.5 ELECP_K.5 ELECPU_K.5 EMER_K.5 EMERG_K.5 ENG1_K.5 ENG1B_K.5 ENG1P_K.5 ENG2_K.5 ENG2B_K.5 ENG2P_K.5 ENG_MAN_1_K.5 ENG_MAN_2_K.5 EXTP_K.5 EXTRACT_K.5 FAC1_K.5 FAC3_K.5 FIRE_1_H.9 FIRE_1_H.10 FIRE_2_H.9 FIRE_2_H.10 FIRE_3_H.9 FIRE_3_H.10 FLAPM_K.5 FWD_K.5 GAL_K.5 GEN1_K.5 GEN2_K.5 HORN_K.5 HOTA_K.5 IDG1_K.5 IDG2_K.5 IR1_K.5 IR2_K.5 IR3_K.5 J02.1 J04.1 J06.1 J08.1 J10.1 J12.1 J14.1 J16.1 J18.1 J20.1 J22.1 J24.1 J26.1 J28.1 J30.1 J32.1 L_AFT_K.5 L_CREW_K.5 L_CVR_E_K.5 L_CVR_T_K.5 L_EMER_K.5 L_FLAP3_K.5 L_FWD_K.5 L_GEN1L_K.5 L_GND_CTL_K.5 L_GS_K.5 L_MASK_K.5 L_MECH_K.5 L_PASS_K.5 L_RAIN_K.5 L_TERR_K.5 LED_BANK_01.8(PIN8) LED_BANK_01.13(PIN13) LED_BANK_02.8(PIN8) LED_BANK_02.13(PIN13) LED_BANK_03.8(PIN8) LED_BANK_03.13(PIN13) LED_BANK_04.8(PIN8) LED_BANK_04.13(PIN13) LED_BANK_05.8(PIN8) LED_BANK_05.13(PIN13) LED_BANK_06.8(PIN8) LED_BANK_06.13(PIN13) LED_BANK_07.8(PIN8) LED_BANK_07.13(PIN13) LED_BANK_08.8(PIN8) LED_BANK_08.13(PIN13) LED_BANK_09.8(PIN8) LED_BANK_09.13(PIN13) LED_BANK_10.8(PIN8) LED_BANK_10.13(PIN13) LED_BANK_11.8(PIN8) LED_BANK_11.13(PIN13) LED_BANK_12.8(PIN8) LED_BANK_12.13(PIN13) LED_BANK_13.8(PIN8) LED_BANK_13.13(PIN13) LED_BANK_14.8(PIN8) LED_BANK_14.13(PIN13) LED_BANK_15.8(PIN8) LED_BANK_15.13(PIN13) LED_BANK_16.8(PIN8) LED_BANK_16.13(PIN13) LED_BANK_17.8(PIN8) LED_BANK_17.13(PIN13) LED_BANK_18.8(PIN8) LED_BANK_18.13(PIN13) LED_BANK_19.8(PIN8) LED_BANK_19.13(PIN13) LED_BANK_20.8(PIN8) LED_BANK_20.13(PIN13) LED_BANK_21.8(PIN8) LED_BANK_21.13(PIN13) LED_BANK_22.8(PIN8) LED_BANK_22.13(PIN13) LED_BANK_23.8(PIN8) LED_BANK_23.13(PIN13) LED_BANK_24.8(PIN8) LED_BANK_24.13(PIN13) LED_BANK_25.8(PIN8) LED_BANK_25.13(PIN13) LED_BANK_26.8(PIN8) LED_BANK_26.13(PIN13) LED_BANK_27.8(PIN8) LED_BANK_27.13(PIN13) LED_BANK_28.8(PIN8) LED_BANK_28.13(PIN13) LED_BANK_29.8(PIN8) LED_BANK_29.13(PIN13) LED_BANK_30.8(PIN8) LED_BANK_30.13(PIN13) LED_BANK_31.8(PIN8) LED_BANK_31.13(PIN13) LED_BANK_32.8(PIN8) LED_BANK_32.13(PIN13) LED_OUT_01.4 LED_OUT_02.9 LED_OUT_02.10 LED_OUT_03.9 LED_OUT_03.10 LED_OUT_04.9 LED_OUT_04.10 LED_OUT_05.9 LED_OUT_05.10 LED_OUT_06.9 LED_OUT_06.10 LED_OUT_07.9 LED_OUT_07.10 LED_OUT_08.9 LED_OUT_08.10 LTKP1_K.5 LTKP2_K.5 MANON_K.5 MASTER_K.5 MODESEL_K.5 MSEL_K.5 N1_MODE_1_K.5 N1_MODE_2_K.5 NEG.1 PACK1_K.5 PACK2_K.5 PROBE_K.5 PTU_K.5 R001.2 R002.2 R003.2 R004.2 R005.2 R006.2 R007.2 R008.2 R009.2 R010.2 R011.2 R012.2 R013.2 R014.2 R015.2 R016.2 R017.2 R018.2 R019.2 R020.2 R021.2 R022.2 R023.2 R024.2 R025.2 R026.2 R027.2 R028.2 R029.2 R030.2 R031.2 R032.2 R033.2 R034.2 R035.2 R036.2 R037.2 R038.2 R039.2 R040.2 R041.2 R042.2 R043.2 R044.2 R045.2 R046.2 R047.2 R048.2 R049.2 R050.2 R051.2 R052.2 R053.2 R054.2 R055.2 R056.2 R057.2 R058.2 R059.2 R060.2 R061.2 R062.2 R063.2 R064.2 R065.2 R066.2 R067.2 R068.2 R069.2 R070.2 R071.2 R072.2 R073.2 R074.2 R075.2 R076.2 R077.2 R078.2 R079.2 R080.2 R081.2 R082.2 R083.2 R084.2 R085.2 R086.2 R087.2 R088.2 R089.2 R090.2 R091.2 R092.2 R093.2 R094.2 R095.2 R096.2 R097.2 R098.2 R099.2 R100.2 R101.2 R102.2 R103.2 R104.2 R105.2 R106.2 R107.2 R108.2 R109.2 R110.2 R111.2 R112.2 R113.2 R114.2 R115.2 R116.2 R117.2 R118.2 R119.2 R120.2 R121.2 R122.2 R123.2 R124.2 R125.2 R126.2 R127.2 R128.2 R129.2 R130.2 R131.2 R132.2 R133.2 R134.2 R135.2 R136.2 R137.2 R138.2 R139.2 R140.2 R141.2 R142.2 R143.2 R144.2 R_DISCH_1_K.5 R_DISCH_2_K.5 R_TEST_K.5 RAIN_01_K.5 RAM_K.5 RAT_EMER_K.5 RAT_K.5 RLY1.1 RLY2.1 RLY3.1 RTKP1_K.5 RTKP2_K.5 SEC1_K.5 SEC2_K.5 SEC3_K.5 START_K.5 SYS_K.5 TEST1_K.5 TEST2_K.5 TEST_APU_K.5 WING_K.5 XFEED_K.5
A_01: A01.2 ARD_01_H1.1
A_02: A02.2 ARD_01_H1.2
A_03: A03.2 ARD_01_H1.3
A_04: A04.2 ARD_01_H1.4
A_05: A05.2 ARD_02_H1.1
A_06: A06.2 ARD_02_H1.2
A_07: A07.2 ARD_02_H1.3
A_08: A08.2 ARD_02_H1.4
A_09: A09.2 ARD_03_H1.1
A_10: A10.2 ARD_03_H1.2
A_11: A11.2 ARD_03_H1.3
A_12: A12.2 ARD_03_H1.4
A_13: A13.2 ARD_04_H1.1
A_14: A14.2 ARD_04_H1.2
A_15: A15.2 ARD_04_H1.3
A_16: A16.2 ARD_04_H1.4
Ard_1_5v: A01.1 A02.1 A03.1 A04.1 ANN_S.2 ARD_01_H3_01.5 ARD_01_H3_01.6 BEACON_S.2 DITCHING_K.2 EMER_K.2 ENG1_K.2 ENG2_K.2 EXIT_S.2 FIRE_1_H.12 FIRE_2_H.12 FIRE_3_H.12 ICE_S.2 LANDL_S.2 LANDR_S.2 MAN_S.2 MASTER_K.2 MODESEL_K.2 NAV_S.2 NOSE_S.2 PROBE_K.2 RWY_S.2 SEAT_S.2 SMOKE_S.2 START_K.2 STROBE_S.2 WING_K.2 WING_S.2
Ard_1_33v: ARD_01_H3_01.7 ARD_01_H3_01.8 ARDUINO_01_OUT_01.5 ARDUINO_01_OUT_01.6
ARD_01_OUT_01: ARD_01_H3_01.34 ARDUINO_01_OUT_02.10
ARD_01_OUT_02: ARD_01_H3_01.35 ARDUINO_01_OUT_02.9
ARD_01_OUT_03: ARD_01_H3_01.36 ARDUINO_01_OUT_02.8
ARD_01_OUT_04: ARD_01_H3_01.37 ARDUINO_01_OUT_02.7
ARD_01_OUT_05: ARD_01_H3_01.38 ARDUINO_01_OUT_02.6
ARD_01_OUT_06: ARD_01_H3_01.39 ARDUINO_01_OUT_02.5
ARD_01_OUT_07: ARD_01_H3_01.40 ARDUINO_01_OUT_02.4
ARD_01_OUT_08: ARD_01_H3_02.1 ARDUINO_01_OUT_02.3
ARD_01_OUT_09: ARD_01_H3_02.2 ARDUINO_01_OUT_02.1 ARDUINO_01_OUT_02.2
Ard_2_5v: A05.1 A06.1 A07.1 A08.1 ACESS_K.2 AGENT1_1_K.2 AGENT1_2_K.2 AGENTAPU_K.2 APUB_K.2 APUGEN_K.2 ARD_02_H3_01.5 ARD_02_H3_01.6 BAT1_K.2 BAT2_K.2 BUS_K.2 CTRPKP1_K.2 CTRPKP2_K.2 ELECP_K.2 ELECPU_K.2 ENG1B_K.2 ENG1P_K.2 ENG2B_K.2 ENG2P_K.2 EXTP_K.2 GAL_K.2 GEN1_K.2 GEN2_K.2 HOTA_K.2 IDG1_K.2 IDG2_K.2 LTKP1_K.2 LTKP2_K.2 MSEL_K.2 PACK1_K.2 PACK2_K.2 PTU_K.2 RAM_K.2 RAT_K.2 RTKP1_K.2 RTKP2_K.2 TEST1_K.2 XFEED_K.2
Ard_2_33v: ARD_02_H3_01.7 ARD_02_H3_01.8 ARDUINO_02_OUT_1.1 ARDUINO_02_OUT_1.2
ARD_02_OUT_01: ARD_02_H3_01.34 ARDUINO_02_OUT_2.1
ARD_02_OUT_02: ARD_02_H3_01.35 ARDUINO_02_OUT_2.2
ARD_02_OUT_03: ARD_02_H3_01.36 ARDUINO_02_OUT_2.3
ARD_02_OUT_04: ARD_02_H3_01.37 ARDUINO_02_OUT_2.4
ARD_02_OUT_05: ARD_02_H3_01.38 ARDUINO_02_OUT_2.5
ARD_02_OUT_06: ARD_02_H3_01.39 ARDUINO_02_OUT_2.6
ARD_02_OUT_07: ARD_02_H3_01.40 ARDUINO_02_OUT_2.7
ARD_02_OUT_08: ARD_02_H3_2.1 ARDUINO_02_OUT_2.8
ARD_02_OUT_09: ARD_02_H3_2.2 ARDUINO_02_OUT_2.9 ARDUINO_02_OUT_2.10
ARD_02_OUT_11: ARD_03_H3_2.2 ARDUINO_03_OUT_2.11
ARD_02_OUT_12: ARD_03_H3_2.1 ARDUINO_03_OUT_2.12
Ard_3_5v: A09.1 A10.1 A11.1 A12.1 AFT_K.2 AGENT2_1_K.2 AGENT2_2_K.2 ARD_03_H3_01.5 ARD_03_H3_01.6 BLOWER_K.2 CABFAN_K.2 ELAC2_K.2 ENG_MAN_1_K.2 ENG_MAN_2_K.2 EXTRACT_K.2 FAC3_K.2 FWD_K.2 L_AFT_K.2 L_CREW_K.2 L_CVR_E_K.2 L_CVR_T_K.2 L_EMER_K.2 L_FLAP3_K.2 L_FWD_K.2 L_GEN1L_K.2 L_GND_CTL_K.2 L_GS_K.2 L_MASK_K.2 L_MECH_K.2 L_PASS_K.2 L_RAIN_K.2 L_TERR_K.2 N1_MODE_1_K.2 N1_MODE_2_K.2 R_DISCH_1_K.2 R_DISCH_2_K.2 R_TEST_K.2 RAIN_01_K.2 SEC2_K.2 SEC3_K.2 TEST2_K.2 TEST_APU_K.2
Ard_3_33v: ARD_03_H3_01.7 ARD_03_H3_01.8 ARDUINO_03_OUT_1.1 ARDUINO_03_OUT_1.2
ARD_03_OUT_01: ARD_03_H3_01.32 ARDUINO_03_OUT_2.1
ARD_03_OUT_02: ARD_03_H3_01.31 ARDUINO_03_OUT_2.2
ARD_03_OUT_03: ARD_03_H3_01.34 ARDUINO_03_OUT_2.3
ARD_03_OUT_04: ARD_03_H3_01.33 ARDUINO_03_OUT_2.4
ARD_03_OUT_05: ARD_03_H3_01.36 ARDUINO_03_OUT_2.5
ARD_03_OUT_06: ARD_03_H3_01.35 ARDUINO_03_OUT_2.6
ARD_03_OUT_07: ARD_03_H3_01.38 ARDUINO_03_OUT_2.7
ARD_03_OUT_08: ARD_03_H3_01.37 ARDUINO_03_OUT_2.8
ARD_03_OUT_09: ARD_03_H3_01.40 ARDUINO_03_OUT_2.9
ARD_03_OUT_10: ARD_03_H3_01.39 ARDUINO_03_OUT_2.10
Ard_4_5v: A13.1 A14.1 A15.1 A16.1 ADR1_K.2 ADR2_K.2 ADR3_K.2 ARD_04_H3_01.5 ARD_04_H3_01.6 CAPT.2 COMM_K.2 ELAC1_K.2 EMERG_K.2 FAC1_K.2 FLAPM_K.2 HORN_K.2 IR1_K.2 IR2_K.2 IR3_K.2 MANON_K.2 RAT_EMER_K.2 SEC1_K.2 SYS_K.2
Ard_4_33v: ARD_04_H3_01.7 ARD_04_H3_01.8 ARDUINO_04_OUT_1.1 ARDUINO_04_OUT_1.2
ARD_04_OUT_01: ARD_04_H3_01.32 ARDIUNO_04_OUT_2.2
ARD_04_OUT_02: ARD_04_H3_01.31 ARDIUNO_04_OUT_2.1
ARD_04_OUT_03: ARD_04_H3_01.34 ARDIUNO_04_OUT_2.4
ARD_04_OUT_04: ARD_04_H3_01.33 ARDIUNO_04_OUT_2.3
ARD_04_OUT_05: ARD_04_H3_01.36 ARDIUNO_04_OUT_2.6
ARD_04_OUT_06: ARD_04_H3_01.35 ARDIUNO_04_OUT_2.5
ARD_04_OUT_07: ARD_04_H3_01.38 ARDIUNO_04_OUT_2.8
ARD_04_OUT_08: ARD_04_H3_01.37 ARDIUNO_04_OUT_2.7
ARD_04_OUT_09: ARD_04_H3_01.40 ARDIUNO_04_OUT_2.10
ARD_04_OUT_10: ARD_04_H3_01.39 ARDIUNO_04_OUT_2.9
ARD_04_OUT_11: ARD_04_H3_02.2 ARDIUNO_04_OUT_2.12
ARD_04_OUT_12: ARD_04_H3_02.1 ARDIUNO_04_OUT_2.11
AREF_01: ARD_01_H3_01.9 ARDUINO_01_OUT_01.3
AREF_02: ARD_02_H3_01.9 ARDUINO_02_OUT_1.3
AREF_03: ARD_03_H3_01.9 ARDUINO_03_OUT_1.3
AREF_04: ARD_04_H3_01.9 ARDUINO_04_OUT_1.3
CAN_01_01_CS: ARD_01_H3_01.28 CAN_01_01.5
CAN_01_01_INT: ARD_01_H3_01.24 CAN_01_01.1
CAN_01_01_SCK: ARD_01_H3_01.27 CAN_01_01.2
CAN_01_01_SI: ARD_01_H3_01.26 CAN_01_01.3
CAN_01_01_SO: ARD_01_H3_01.25 CAN_01_01.4
CAN_01_02_CS: ARD_01_H3_01.29 CAN_01_02.5
CAN_01_02_INT: ARD_01_H3_01.32 CAN_01_02.1
CAN_01_02_SCK: ARD_01_H3_01.33 CAN_01_02.2
CAN_01_02_SI: ARD_01_H3_01.30 CAN_01_02.3
CAN_01_02_SO: ARD_01_H3_01.31 CAN_01_02.4
CAN_02_01_CS: ARD_02_H3_01.28 CAN_02_01.5
CAN_02_01_INT: ARD_02_H3_01.24 CAN_02_01.1
CAN_02_01_SCK: ARD_02_H3_01.25 CAN_02_01.2
CAN_02_01_SI: ARD_02_H3_01.26 CAN_02_01.3
CAN_02_01_SO: ARD_02_H3_01.27 CAN_02_01.4
CAN_02_02_CS: ARD_02_H3_01.33 CAN_02_02.5
CAN_02_02_INT: ARD_02_H3_01.30 CAN_02_02.1
CAN_02_02_SCK: ARD_02_H3_01.29 CAN_02_02.2
CAN_02_02_SI: ARD_02_H3_01.32 CAN_02_02.3
CAN_02_02_SO: ARD_02_H3_01.31 CAN_02_02.4
CAN_03_01_CS: ARD_03_H3_01.26 CAN_03_01.5
CAN_03_01_INT: ARD_03_H3_01.22 CAN_03_01.1
CAN_03_01_SCK: ARD_03_H3_01.21 CAN_03_01.2
CAN_03_01_SI: ARD_03_H3_01.24 CAN_03_01.3
CAN_03_01_SO: ARD_03_H3_01.23 CAN_03_01.4
CAN_03_02_CS: ARD_03_H3_01.30 CAN_03_02.5
CAN_03_02_INT: ARD_03_H3_01.28 CAN_03_02.1
CAN_03_02_SCK: ARD_03_H3_01.25 CAN_03_02.2
CAN_03_02_SI: ARD_03_H3_01.29 CAN_03_02.3
CAN_03_02_SO: ARD_03_H3_01.27 CAN_03_02.4
CAN_04_01_CS: ARD_04_H3_01.26 CAN_04_01.5
CAN_04_01_INT: ARD_04_H3_01.22 CAN_04_01.1
CAN_04_01_SCK: ARD_04_H3_01.21 CAN_04_01.2
CAN_04_01_SI: ARD_04_H3_01.24 CAN_04_01.3
CAN_04_01_SO: ARD_04_H3_01.23 CAN_04_01.4
CAN_04_02_CS: ARD_04_H3_01.30 CAN_04_02.5
CAN_04_02_INT: ARD_04_H3_01.28 CAN_04_02.1
CAN_04_02_SCK: ARD_04_H3_01.25 CAN_04_02.2
CAN_04_02_SI: ARD_04_H3_01.29 CAN_04_02.3
CAN_04_02_SO: ARD_04_H3_01.27 CAN_04_02.4
DISPLAY_01_01: ARD_01_H3_01.21 DISPLAY_01.9
DISPLAY_01_02: ARD_01_H3_01.22 DISPLAY_01.10
DISPLAY_01_03: ARD_01_H3_01.23 DISPLAY_01.11
DISPLAY_02_01: ARD_02_H3_01.21 DISPLAY_02.9
DISPLAY_02_02: ARD_02_H3_01.22 DISPLAY_02.10
DISPLAY_02_03: ARD_02_H3_01.23 DISPLAY_02.11
EP_01_5V: CAN_01_01.7 CAN_01_02.7 J19.1 LED_BANK_01.10(PIN10) LED_BANK_01.16(PIN16) LED_BANK_02.10(PIN10) LED_BANK_02.16(PIN16) LED_BANK_03.10(PIN10) LED_BANK_03.16(PIN16) LED_BANK_04.10(PIN10) LED_BANK_04.16(PIN16) LED_BANK_05.10(PIN10) LED_BANK_05.16(PIN16) LED_BANK_06.10(PIN10) LED_BANK_06.16(PIN16) LED_BANK_07.10(PIN10) LED_BANK_07.16(PIN16) LED_BANK_08.10(PIN10) LED_BANK_08.16(PIN16)
EP_01_5V_M: FUSEBOX.1 J01.1 J05.1 J09.1 J13.1 J17.1 J21.1 J25.1 J29.1
EP_01_7V: ARD_01_H3_01.1 ARD_01_H3_01.2 J03.1
EP_02_5V: CAN_02_01.7 CAN_02_02.7 J23.1 LED_BANK_09.10(PIN10) LED_BANK_09.16(PIN16) LED_BANK_10.10(PIN10) LED_BANK_10.16(PIN16) LED_BANK_11.10(PIN10) LED_BANK_11.16(PIN16) LED_BANK_12.10(PIN10) LED_BANK_12.16(PIN16) LED_BANK_13.10(PIN10) LED_BANK_13.16(PIN16) LED_BANK_14.10(PIN10) LED_BANK_14.16(PIN16) LED_BANK_15.10(PIN10) LED_BANK_15.16(PIN16) LED_BANK_16.10(PIN10) LED_BANK_16.16(PIN16)
EP_02_7V: ARD_02_H3_01.1 ARD_02_H3_01.2 J07.1
EP_03_5V: CAN_03_01.7 CAN_03_02.7 D8.1(K) DOME.2 J27.1 LED_BANK_17.10(PIN10) LED_BANK_17.16(PIN16) LED_BANK_18.10(PIN10) LED_BANK_18.16(PIN16) LED_BANK_19.10(PIN10) LED_BANK_19.16(PIN16) LED_BANK_20.10(PIN10) LED_BANK_20.16(PIN16) LED_BANK_21.10(PIN10) LED_BANK_21.16(PIN16) LED_BANK_22.10(PIN10) LED_BANK_22.16(PIN16) LED_BANK_23.10(PIN10) LED_BANK_23.16(PIN16) LED_BANK_24.10(PIN10) LED_BANK_24.16(PIN16) RLY3.4
EP_03_7V: ARD_03_H3_01.1 ARD_03_H3_01.2 J11.1
EP_04_5V: CAN_04_01.7 CAN_04_02.7 J31.1 LED_BANK_25.10(PIN10) LED_BANK_25.16(PIN16) LED_BANK_26.10(PIN10) LED_BANK_26.16(PIN16) LED_BANK_27.10(PIN10) LED_BANK_27.16(PIN16) LED_BANK_28.10(PIN10) LED_BANK_28.16(PIN16) LED_BANK_29.10(PIN10) LED_BANK_29.16(PIN16) LED_BANK_30.10(PIN10) LED_BANK_30.16(PIN16) LED_BANK_31.10(PIN10) LED_BANK_31.16(PIN16) LED_BANK_32.10(PIN10) LED_BANK_32.16(PIN16)
EP_04_7V: ARD_04_H3_01.1 ARD_04_H3_01.2 J15.1
LED_BANK_01_A: LED_BANK_01.15(PIN15) R145.1
LED_BANK_01_B: LED_BANK_01.1(PIN1) R149.1
LED_BANK_01_C: LED_BANK_01.2(PIN2) R146.1
LED_BANK_01_D: LED_BANK_01.3(PIN3) R150.1
LED_BANK_01_E: LED_BANK_01.4(PIN4) R151.2
LED_BANK_01_F: LED_BANK_01.5(PIN5) R147.2
LED_BANK_01_G: LED_BANK_01.6(PIN6) R152.2
LED_BANK_01_H: LED_BANK_01.7(PIN7) R148.2
LED_BANK_01_OUT: LED_BANK_01.9(PIN9) LED_BANK_02.14(PIN14)
LED_BANK_02_A: LED_BANK_02.15(PIN15) R160.1
LED_BANK_02_B: LED_BANK_02.1(PIN1) R156.1
LED_BANK_02_C: LED_BANK_02.2(PIN2) R159.1
LED_BANK_02_D: LED_BANK_02.3(PIN3) R155.1
LED_BANK_02_E: LED_BANK_02.4(PIN4) R154.2
LED_BANK_02_F: LED_BANK_02.5(PIN5) R158.2
LED_BANK_02_G: LED_BANK_02.6(PIN6) R153.2
LED_BANK_02_H: LED_BANK_02.7(PIN7) R157.2
LED_BANK_02_OUT: LED_BANK_02.9(PIN9) LED_BANK_03.14(PIN14)
LED_BANK_03_A: LED_BANK_03.15(PIN15) R168.1
LED_BANK_03_B: LED_BANK_03.1(PIN1) R164.1
LED_BANK_03_C: LED_BANK_03.2(PIN2) R167.1
LED_BANK_03_D: LED_BANK_03.3(PIN3) R163.1
LED_BANK_03_E: LED_BANK_03.4(PIN4) R162.2
LED_BANK_03_F: LED_BANK_03.5(PIN5) R166.2
LED_BANK_03_G: LED_BANK_03.6(PIN6) R161.2
LED_BANK_03_H: LED_BANK_03.7(PIN7) R165.2
LED_BANK_03_OUT: LED_BANK_03.9(PIN9) LED_BANK_04.14(PIN14)
LED_BANK_04_A: LED_BANK_04.15(PIN15) R170.2
LED_BANK_04_B: LED_BANK_04.1(PIN1) R169.1
LED_BANK_04_C: LED_BANK_04.2(PIN2) R171.2
LED_BANK_04_D: LED_BANK_04.3(PIN3) R172.1
LED_BANK_04_E: LED_BANK_04.4(PIN4) R174.2
LED_BANK_04_F: LED_BANK_04.5(PIN5) R173.1
LED_BANK_04_G: LED_BANK_04.6(PIN6) R175.2
LED_BANK_04_H: LED_BANK_04.7(PIN7) R176.2
LED_BANK_05_A: LED_BANK_05.15(PIN15) R177.1
LED_BANK_05_B: LED_BANK_05.1(PIN1) R178.2
LED_BANK_05_C: LED_BANK_05.2(PIN2) R179.1
LED_BANK_05_D: LED_BANK_05.3(PIN3) R181.2
LED_BANK_05_E: LED_BANK_05.4(PIN4) R180.1
LED_BANK_05_F: LED_BANK_05.5(PIN5) R182.2
LED_BANK_05_G: LED_BANK_05.6(PIN6) R183.2
LED_BANK_05_H: LED_BANK_05.7(PIN7) R184.2
LED_BANK_05_OUT: LED_BANK_05.9(PIN9) LED_BANK_06.14(PIN14)
LED_BANK_06_A: LED_BANK_06.15(PIN15) R185.1
LED_BANK_06_B: LED_BANK_06.1(PIN1) R187.2
LED_BANK_06_C: LED_BANK_06.2(PIN2) R186.1
LED_BANK_06_D: LED_BANK_06.3(PIN3) R188.2
LED_BANK_06_E: LED_BANK_06.4(PIN4) R189.1
LED_BANK_06_F: LED_BANK_06.5(PIN5) R191.2
LED_BANK_06_G: LED_BANK_06.6(PIN6) R190.1
LED_BANK_06_H: LED_BANK_06.7(PIN7) R192.2
LED_BANK_06_OUT: LED_BANK_06.9(PIN9) LED_BANK_07.14(PIN14)
LED_BANK_07_A: LED_BANK_07.15(PIN15) R193.2
LED_BANK_07_B: LED_BANK_07.1(PIN1) R194.1
LED_BANK_07_C: LED_BANK_07.2(PIN2) R196.2
LED_BANK_07_D: LED_BANK_07.3(PIN3) R195.1
LED_BANK_07_E: LED_BANK_07.4(PIN4) R197.2
LED_BANK_07_F: LED_BANK_07.5(PIN5) R198.1
LED_BANK_07_G: LED_BANK_07.6(PIN6) R200.2
LED_BANK_07_H: LED_BANK_07.7(PIN7) R199.1
LED_BANK_07_OUT: LED_BANK_07.9(PIN9) LED_BANK_08.14(PIN14)
LED_BANK_08_A: LED_BANK_08.15(PIN15) R201.2
LED_BANK_08_B: LED_BANK_08.1(PIN1) R202.1
LED_BANK_08_C: LED_BANK_08.2(PIN2) R204.2
LED_BANK_08_D: LED_BANK_08.3(PIN3) R203.1
LED_BANK_08_E: LED_BANK_08.4(PIN4) R205.2
LED_BANK_08_F: LED_BANK_08.5(PIN5) R206.2
LED_BANK_08_G: LED_BANK_08.6(PIN6) R207.2
LED_BANK_08_H: LED_BANK_08.7(PIN7) R208.1
LED_BANK_09_A: LED_BANK_09.15(PIN15) R210.2
LED_BANK_09_B: LED_BANK_09.1(PIN1) R209.1
LED_BANK_09_C: LED_BANK_09.2(PIN2) R211.2
LED_BANK_09_D: LED_BANK_09.3(PIN3) R212.1
LED_BANK_09_E: LED_BANK_09.4(PIN4) R214.2
LED_BANK_09_F: LED_BANK_09.5(PIN5) R213.1
LED_BANK_09_G: LED_BANK_09.6(PIN6) R215.2
LED_BANK_09_H: LED_BANK_09.7(PIN7) R217.2
LED_BANK_09_OUT: LED_BANK_09.9(PIN9) LED_BANK_10.14(PIN14)
LED_BANK_10_A: DISPLAY_01.1 LED_BANK_10.15(PIN15)
LED_BANK_10_B: DISPLAY_01.2 LED_BANK_10.1(PIN1)
LED_BANK_10_C: DISPLAY_01.3 LED_BANK_10.2(PIN2)
LED_BANK_10_D: DISPLAY_01.4 LED_BANK_10.3(PIN3)
LED_BANK_10_E: DISPLAY_01.5 LED_BANK_10.4(PIN4)
LED_BANK_10_F: DISPLAY_01.6 LED_BANK_10.5(PIN5)
LED_BANK_10_G: DISPLAY_01.7 LED_BANK_10.6(PIN6)
LED_BANK_10_H: DISPLAY_01.8 LED_BANK_10.7(PIN7)
LED_BANK_10_OUT: LED_BANK_10.9(PIN9) LED_BANK_11.14(PIN14)
LED_BANK_11_A: DISPLAY_02.1 LED_BANK_11.15(PIN15)
LED_BANK_11_B: DISPLAY_02.2 LED_BANK_11.1(PIN1)
LED_BANK_11_C: DISPLAY_02.3 LED_BANK_11.2(PIN2)
LED_BANK_11_D: DISPLAY_02.4 LED_BANK_11.3(PIN3)
LED_BANK_11_E: DISPLAY_02.5 LED_BANK_11.4(PIN4)
LED_BANK_11_F: DISPLAY_02.6 LED_BANK_11.5(PIN5)
LED_BANK_11_G: DISPLAY_02.7 LED_BANK_11.6(PIN6)
LED_BANK_11_H: DISPLAY_02.8 LED_BANK_11.7(PIN7)
LED_BANK_11_OUT: LED_BANK_11.9(PIN9) LED_BANK_12.14(PIN14)
LED_BANK_12_A: LED_BANK_12.15(PIN15) R216.1
LED_BANK_12_B: LED_BANK_12.1(PIN1) R218.2
LED_BANK_12_C: LED_BANK_12.2(PIN2) R219.1
LED_BANK_12_D: LED_BANK_12.3(PIN3) R221.2
LED_BANK_12_E: LED_BANK_12.4(PIN4) R220.1
LED_BANK_12_F: LED_BANK_12.5(PIN5) R222.2
LED_BANK_12_G: LED_BANK_12.6(PIN6) R223.1
LED_BANK_12_H: LED_BANK_12.7(PIN7) R225.2
LED_BANK_13_A: LED_BANK_13.15(PIN15) R224.1
LED_BANK_13_B: LED_BANK_13.1(PIN1) R226.2
LED_BANK_13_C: LED_BANK_13.2(PIN2) R227.1
LED_BANK_13_D: LED_BANK_13.3(PIN3) R229.2
LED_BANK_13_E: LED_BANK_13.4(PIN4) R228.1
LED_BANK_13_F: LED_BANK_13.5(PIN5) R230.2
LED_BANK_13_G: LED_BANK_13.6(PIN6) R231.1
LED_BANK_13_H: LED_BANK_13.7(PIN7) R233.2
LED_BANK_13_OUT: LED_BANK_13.9(PIN9) LED_BANK_14.14(PIN14)
LED_BANK_14_A: LED_BANK_14.15(PIN15) R232.1
LED_BANK_14_B: LED_BANK_14.1(PIN1) R234.2
LED_BANK_14_C: LED_BANK_14.2(PIN2) R235.2
LED_BANK_14_D: LED_BANK_14.3(PIN3) R236.1
LED_BANK_14_E: LED_BANK_14.4(PIN4) R238.2
LED_BANK_14_F: LED_BANK_14.5(PIN5) R237.1
LED_BANK_14_G: LED_BANK_14.6(PIN6) R239.2
LED_BANK_14_H: LED_BANK_14.7(PIN7) R240.1
LED_BANK_14_OUT: LED_BANK_14.9(PIN9) LED_BANK_15.14(PIN14)
LED_BANK_15_A: LED_BANK_15.15(PIN15) R242.2
LED_BANK_15_B: LED_BANK_15.1(PIN1) R241.1
LED_BANK_15_C: LED_BANK_15.2(PIN2) R243.2
LED_BANK_15_D: LED_BANK_15.3(PIN3) R244.1
LED_BANK_15_E: LED_BANK_15.4(PIN4) R246.2
LED_BANK_15_F: LED_BANK_15.5(PIN5) R247.2
LED_BANK_15_G: LED_BANK_15.6(PIN6) R245.1
LED_BANK_15_H: LED_BANK_15.7(PIN7) R248.2
LED_BANK_15_OUT: LED_BANK_15.9(PIN9) LED_BANK_16.14(PIN14)
LED_BANK_16_A: LED_BANK_16.15(PIN15) R249.1
LED_BANK_16_B: LED_BANK_16.1(PIN1) R250.2
LED_BANK_16_C: LED_BANK_16.2(PIN2) R251.2
LED_BANK_16_D: LED_BANK_16.3(PIN3) R252.1
LED_BANK_16_E: LED_BANK_16.4(PIN4) R253.2
LED_BANK_16_F: LED_BANK_16.5(PIN5) R255.2
LED_BANK_16_G: LED_BANK_16.6(PIN6) R254.1
LED_BANK_16_H: LED_BANK_16.7(PIN7) R256.2
LED_BANK_17_A: LED_BANK_17.15(PIN15) R257.2
LED_BANK_17_B: LED_BANK_17.1(PIN1) R258.2
LED_BANK_17_C: LED_BANK_17.2(PIN2) R259.2
LED_BANK_17_D: LED_BANK_17.3(PIN3) R260.1
LED_BANK_17_E: LED_BANK_17.4(PIN4) R262.2
LED_BANK_17_F: LED_BANK_17.5(PIN5) R261.1
LED_BANK_17_G: LED_BANK_17.6(PIN6) R263.2
LED_BANK_17_H: LED_BANK_17.7(PIN7) R264.2
LED_BANK_17_OUT: LED_BANK_17.9(PIN9) LED_BANK_18.14(PIN14)
LED_BANK_18_A: LED_BANK_18.15(PIN15) R265.1
LED_BANK_18_B: LED_BANK_18.1(PIN1) R267.2
LED_BANK_18_C: LED_BANK_18.2(PIN2) R266.1
LED_BANK_18_D: LED_BANK_18.3(PIN3) R268.2
LED_BANK_18_E: LED_BANK_18.4(PIN4) R269.2
LED_BANK_18_F: LED_BANK_18.5(PIN5) R270.2
LED_BANK_18_G: LED_BANK_18.6(PIN6) R271.2
LED_BANK_18_H: LED_BANK_18.7(PIN7) R272.2
LED_BANK_18_OUT: LED_BANK_18.9(PIN9) LED_BANK_19.14(PIN14)
LED_BANK_19_A: LED_BANK_19.15(PIN15) R274.2
LED_BANK_19_B: LED_BANK_19.1(PIN1) R273.1
LED_BANK_19_C: LED_BANK_19.2(PIN2) R275.2
LED_BANK_19_D: LED_BANK_19.3(PIN3) R276.1
LED_BANK_19_E: LED_BANK_19.4(PIN4) R278.2
LED_BANK_19_F: LED_BANK_19.5(PIN5) R277.1
LED_BANK_19_G: LED_BANK_19.6(PIN6) R280.2
LED_BANK_19_H: LED_BANK_19.7(PIN7) R279.1
LED_BANK_19_OUT: LED_BANK_19.9(PIN9) LED_BANK_20.14(PIN14)
LED_BANK_20_A: LED_BANK_20.15(PIN15) R281.2
LED_BANK_20_B: LED_BANK_20.1(PIN1) R283.2
LED_BANK_20_C: LED_BANK_20.2(PIN2) R282.1
LED_BANK_20_D: LED_BANK_20.3(PIN3) R284.2
LED_BANK_20_E: LED_BANK_20.4(PIN4) R285.2
LED_BANK_20_F: LED_BANK_20.5(PIN5) R286.2
LED_BANK_20_G: LED_BANK_20.6(PIN6) R287.2
